# EAGLE schematic MotherboardRev2(1) (EAGLE 7.2.0)

## Sheet 1 of 12
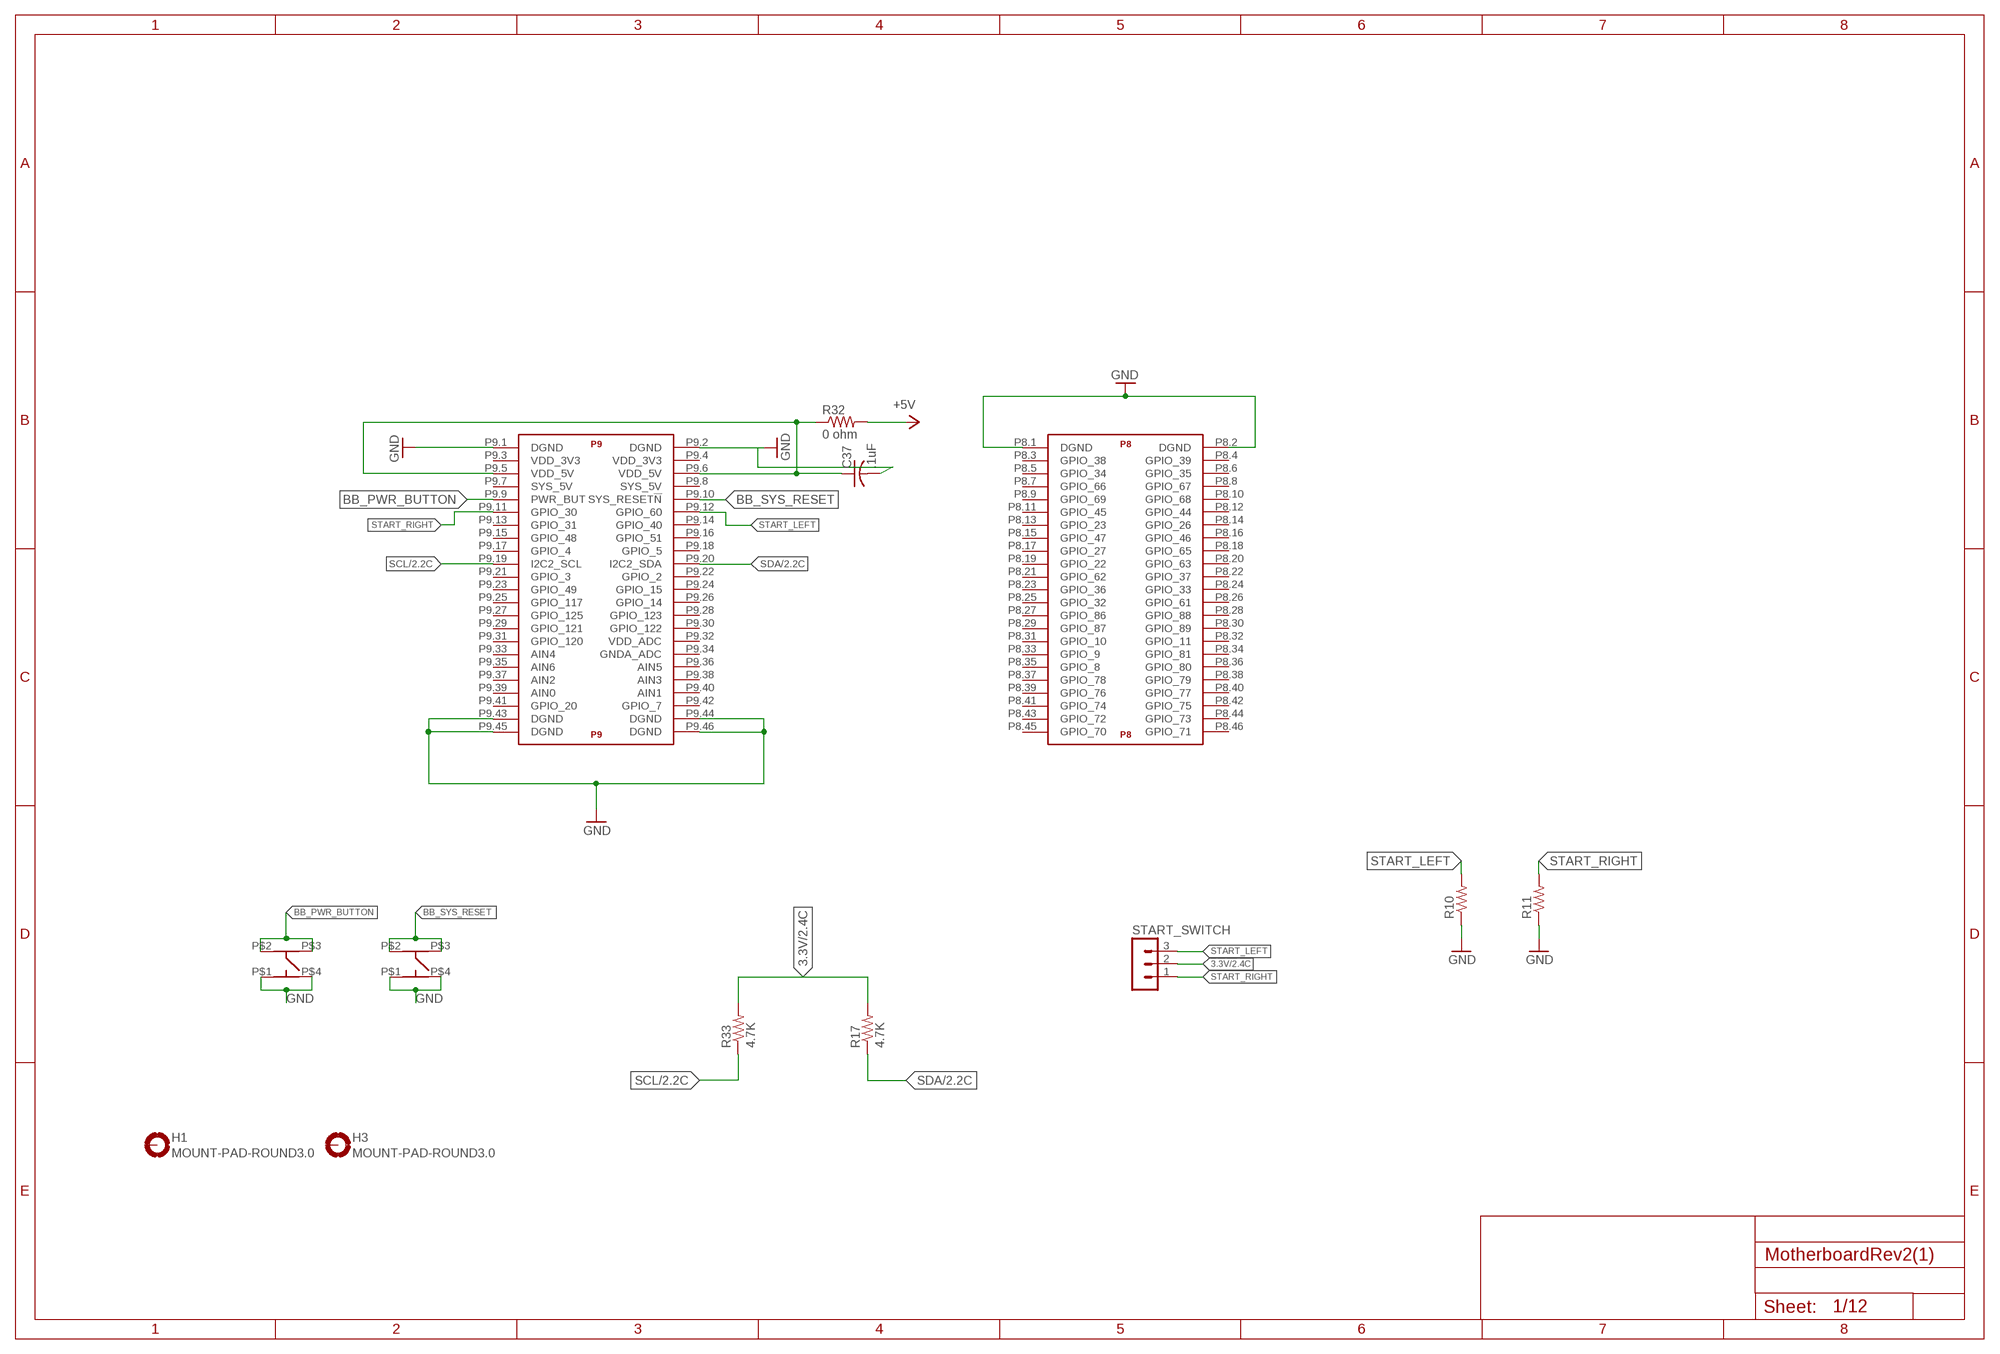
[diagram p0: schematic, sheet 1]

### Parts
C37  .1uF  C-USC0402  [C0402]
H1  MOUNT-PAD-ROUND3.0  [3,0-PAD]
H3  MOUNT-PAD-ROUND3.0  [3,0-PAD]
R10  R-US_R0402  [R0402]
R11  R-US_R0402  [R0402]
R17  4.7K  R-US_R0402  [R0402]
R32  0 ohm  R-US_R0402  [R0402]
R33  4.7K  R-US_R0402  [R0402]
START_SWITCH  MA03-1  [MA03-1]
U$1  BEAGLE_BONE_BLACK_CAPE  [BEAGLE_BONE_BLACK_CAPE]
U$13  Switch1  MC32882_SW  [MC32882_FINAL]
U$14  Switch1  MC32882_SW  [MC32882_FINAL]

### Nets
3.3V: R17.2 R33.2 START_SWITCH.2 ; also sheet 2,3,9,10
BB_PWR_BUTTON: U$1.P9.9(P9:PWR_BUT) U$13.P$2(P2) U$13.P$3(P3)
BB_SYS_RESET: U$1.P9.10(P9:SYS_RESET!N) U$14.P$2(P2) U$14.P$3(P3)
GND: C37.2 R10.1 R11.1 U$1.P8.1(P8:DGND) U$1.P8.2(P8:DGND) U$1.P9.1(P9:DGND) U$1.P9.2(P9:DGND) U$1.P9.43(P9:DGND) U$1.P9.44(P9:DGND) U$1.P9.45(P9:DGND) U$1.P9.46(P9:DGND) U$13.P$1(P1) U$13.P$4(P4) U$14.P$1(P1) U$14.P$4(P4) ; also sheet 2,3,4,5,6,7,8,9,10,11
N$18: C37.1 R32.1 U$1.P9.5(P9:VDD_5V) U$1.P9.6(P9:VDD_5V)
SCL: R33.1 U$1.P9.19(P9:I2C2_SCL) ; also sheet 2,10
SDA: R17.1 U$1.P9.20(P9:I2C2_SDA) ; also sheet 2,10
START_LEFT: R10.2 START_SWITCH.3 U$1.P9.12(P9:GPIO_60)
START_RIGHT: R11.2 START_SWITCH.1 U$1.P9.11(P9:GPIO_30)
VOUT1: R32.2 ; supply symbol labelled +5V ; also sheet 3,4,5
Unconnected: H1.B3,0(MOUNT) H3.B3,0(MOUNT) U$1.P8.3(P8:GPIO_38) U$1.P8.4(P8:GPIO_39) U$1.P8.5(P8:GPIO_34) U$1.P8.6(P8:GPIO_35) U$1.P8.7(P8:GPIO_66) U$1.P8.8(P8:GPIO_67) U$1.P8.9(P8:GPIO_69) U$1.P8.10(P8:GPIO_68) U$1.P8.11(P8:GPIO_45) U$1.P8.12(P8:GPIO_44) U$1.P8.13(P8:GPIO_23) U$1.P8.14(P8:GPIO_26) U$1.P8.15(P8:GPIO_47) U$1.P8.16(P8:GPIO_46) U$1.P8.17(P8:GPIO_27) U$1.P8.18(P8:GPIO_65) U$1.P8.19(P8:GPIO_22) U$1.P8.20(P8:GPIO_63) U$1.P8.21(P8:GPIO_62) U$1.P8.22(P8:GPIO_37) U$1.P8.23(P8:GPIO_36) U$1.P8.24(P8:GPIO_33) U$1.P8.25(P8:GPIO_32) U$1.P8.26(P8:GPIO_61) U$1.P8.27(P8:GPIO_86) U$1.P8.28(P8:GPIO_88) U$1.P8.29(P8:GPIO_87) U$1.P8.30(P8:GPIO_89) U$1.P8.31(P8:GPIO_10) U$1.P8.32(P8:GPIO_11) U$1.P8.33(P8:GPIO_9) U$1.P8.34(P8:GPIO_81) U$1.P8.35(P8:GPIO_8) U$1.P8.36(P8:GPIO_80) U$1.P8.37(P8:GPIO_78) U$1.P8.38(P8:GPIO_79) U$1.P8.39(P8:GPIO_76) U$1.P8.40(P8:GPIO_77) U$1.P8.41(P8:GPIO_74) U$1.P8.42(P8:GPIO_75) U$1.P8.43(P8:GPIO_72) U$1.P8.44(P8:GPIO_73) U$1.P8.45(P8:GPIO_70) U$1.P8.46(P8:GPIO_71) U$1.P9.3(P9:VDD_3V3) U$1.P9.4(P9:VDD_3V3) U$1.P9.7(P9:SYS_5V) U$1.P9.8(P9:SYS_5V) U$1.P9.13(P9:GPIO_31) U$1.P9.14(P9:GPIO_40) U$1.P9.15(P9:GPIO_48) U$1.P9.16(P9:GPIO_51) U$1.P9.17(P9:GPIO_4) U$1.P9.18(P9:GPIO_5) U$1.P9.21(P9:GPIO_3) U$1.P9.22(P9:GPIO_2) U$1.P9.23(P9:GPIO_49) U$1.P9.24(P9:GPIO_15) U$1.P9.25(P9:GPIO_117) U$1.P9.26(P9:GPIO_14) U$1.P9.27(P9:GPIO_125) U$1.P9.28(P9:GPIO_123) U$1.P9.29(P9:GPIO_121) U$1.P9.30(P9:GPIO_122) U$1.P9.31(P9:GPIO_120) U$1.P9.32(P9:VDD_ADC) U$1.P9.33(P9:AIN4) U$1.P9.34(P9:GNDA_ADC) U$1.P9.35(P9:AIN6) U$1.P9.36(P9:AIN5) U$1.P9.37(P9:AIN2) U$1.P9.38(P9:AIN3) U$1.P9.39(P9:AIN0) U$1.P9.40(P9:AIN1) U$1.P9.41(P9:GPIO_20) U$1.P9.42(P9:GPIO_7)

## Sheet 2 of 12
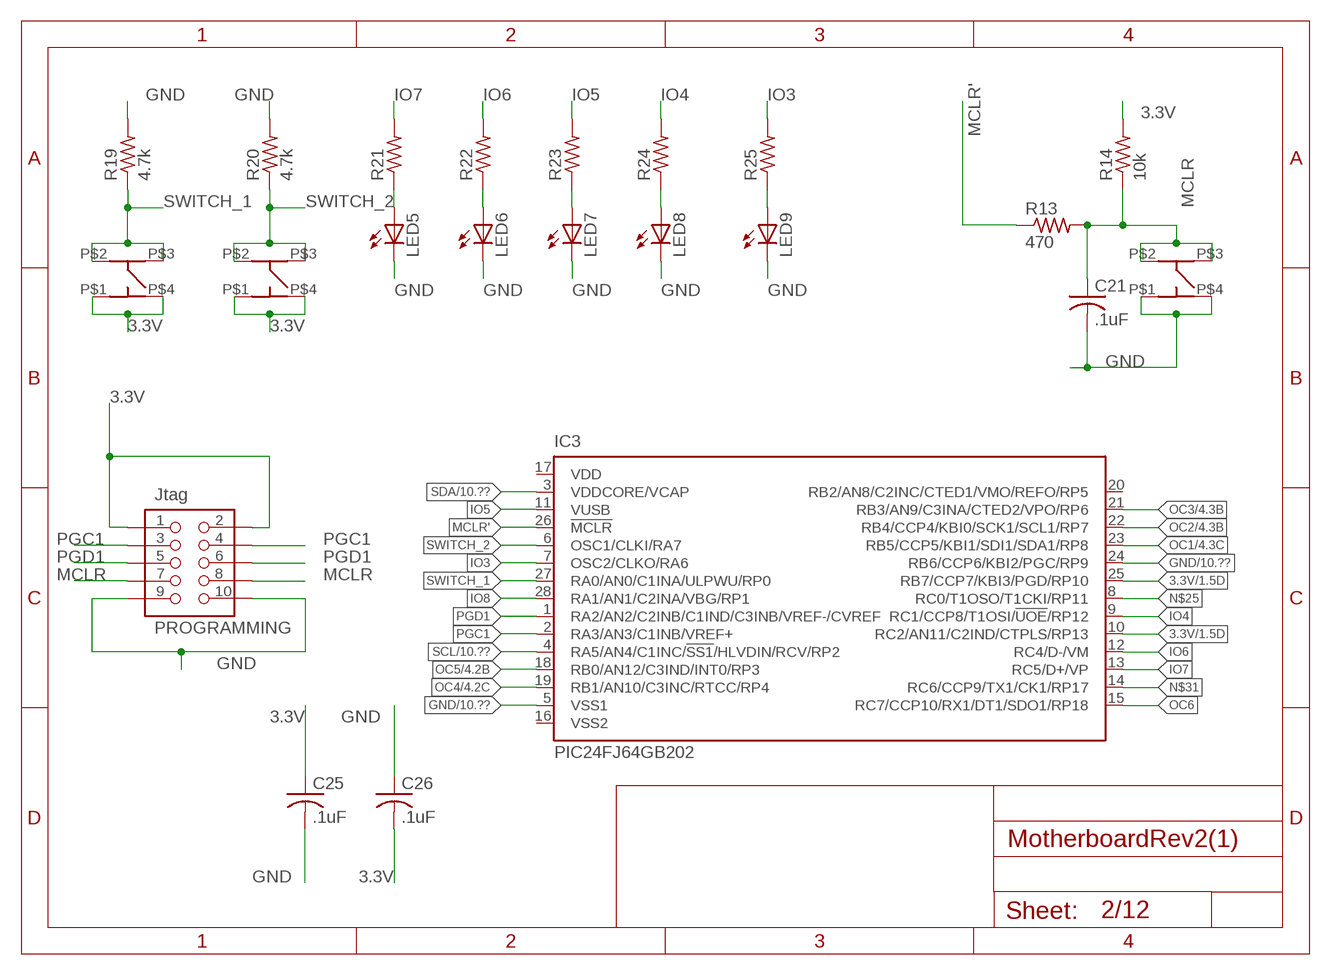
[diagram p1: schematic, sheet 2]

### Parts
C21  .1uF  C-USC0402  [C0402]
C25  .1uF  C-USC0402  [C0402]
C26  .1uF  C-USC0402  [C0402]
IC3  PIC24FJ64GB202  PIC18F26J53ML  [QFN28-ML_6X6MM]
LED5  LEDCHIPLED-0603-TTW  [CHIPLED-0603-TTW]
LED6  LEDCHIPLED-0603-TTW  [CHIPLED-0603-TTW]
LED7  LEDCHIPLED-0603-TTW  [CHIPLED-0603-TTW]
LED8  LEDCHIPLED-0603-TTW  [CHIPLED-0603-TTW]
LED9  LEDCHIPLED-0603-TTW  [CHIPLED-0603-TTW]
PROGRAMMING  Jtag  MOTHER-BOARD-REV5_PIN-CONNECTOR74089  [MOTHER-BOARD-REV5_10-PIN-SMD]
R13  470  R-US_R0402  [R0402]
R14  10k  R-US_R0402  [R0402]
R19  4.7k  R-US_R0402  [R0402]
R20  4.7k  R-US_R0402  [R0402]
R21  R-US_R0402  [R0402]
R22  R-US_R0402  [R0402]
R23  R-US_R0402  [R0402]
R24  R-US_R0402  [R0402]
R25  R-US_R0402  [R0402]
U$5  Switch3  MC32882_SW  [MC32882_FINAL]
U$6  Switch1  MC32882_SW  [MC32882_FINAL]
U$7  Switch2  MC32882_SW  [MC32882_FINAL]

### Nets
3.3V: C25.1 C26.1 IC3.10(RC2/AN11/C2IND/CTPLS/RP13) IC3.25(RB7/CCP7/KBI3/PGD/RP10) PROGRAMMING.1 PROGRAMMING.2 R14.2 U$6.P$1(P1) U$6.P$4(P4) U$7.P$1(P1) U$7.P$4(P4) ; also sheet 1,3,9,10
GND: C21.2 C25.2 C26.2 IC3.5(VSS1) IC3.24(RB6/CCP6/KBI2/PGC/RP9) LED5.C@1(C) LED6.C@1(C) LED7.C@1(C) LED8.C@1(C) LED9.C@1(C) PROGRAMMING.9 PROGRAMMING.10 R19.2 R20.2 U$5.P$1(P1) U$5.P$4(P4) ; also sheet 1,3,4,5,6,7,8,9,10,11
IO3: IC3.7(OSC2/CLKO/RA6) R25.2
IO4: IC3.9(RC1/CCP8/T1OSI/!UOE!/RP12) R24.2
IO5: IC3.11(VUSB) R23.2
IO6: IC3.12(RC4/D-/VM) R22.2
IO7: IC3.13(RC5/D+/VP) R21.2
IO8: IC3.28(RA1/AN1/C2INA/VBG/RP1)
MCLR: C21.1 PROGRAMMING.7 PROGRAMMING.8 R13.2 R14.1 U$5.P$2(P2) U$5.P$3(P3)
MCLR': IC3.26(!MCLR) R13.1
N$5: LED5.A@1(A) R21.1
N$6: LED6.A@1(A) R22.1
N$7: LED7.A@1(A) R23.1
N$8: LED8.A@1(A) R24.1
N$9: LED9.A@1(A) R25.1
N$25: IC3.8(RC0/T1OSO/T1CKI/RP11)
N$31: IC3.14(RC6/CCP9/TX1/CK1/RP17)
OC1: IC3.23(RB5/CCP5/KBI1/SDI1/SDA1/RP8) ; also sheet 4
OC2: IC3.22(RB4/CCP4/KBI0/SCK1/SCL1/RP7) ; also sheet 4
OC3: IC3.21(RB3/AN9/C3INA/CTED2/VPO/RP6) ; also sheet 4
OC4: IC3.19(RB1/AN10/C3INC/RTCC/RP4) ; also sheet 4
OC5: IC3.18(RB0/AN12/C3IND/INT0/RP3) ; also sheet 4
OC6: IC3.15(RC7/CCP10/RX1/DT1/SDO1/RP18) ; also sheet 4
PGC1: IC3.2(RA3/AN3/C1INB/VREF+) PROGRAMMING.3 PROGRAMMING.4
PGD1: IC3.1(RA2/AN2/C2INB/C1IND/C3INB/VREF-/CVREF) PROGRAMMING.5 PROGRAMMING.6
SCL: IC3.4(RA5/AN4/C1INC/!SS1!/HLVDIN/RCV/RP2) ; also sheet 1,10
SDA: IC3.3(VDDCORE/VCAP) ; also sheet 1,10
SWITCH_1: IC3.27(RA0/AN0/C1INA/ULPWU/RP0) R19.1 U$6.P$2(P2) U$6.P$3(P3)
SWITCH_2: IC3.6(OSC1/CLKI/RA7) R20.1 U$7.P$2(P2) U$7.P$3(P3)
Unconnected: IC3.16(VSS2) IC3.17(VDD) IC3.20(RB2/AN8/C2INC/CTED1/VMO/REFO/RP5)

## Sheet 3 of 12: Power System
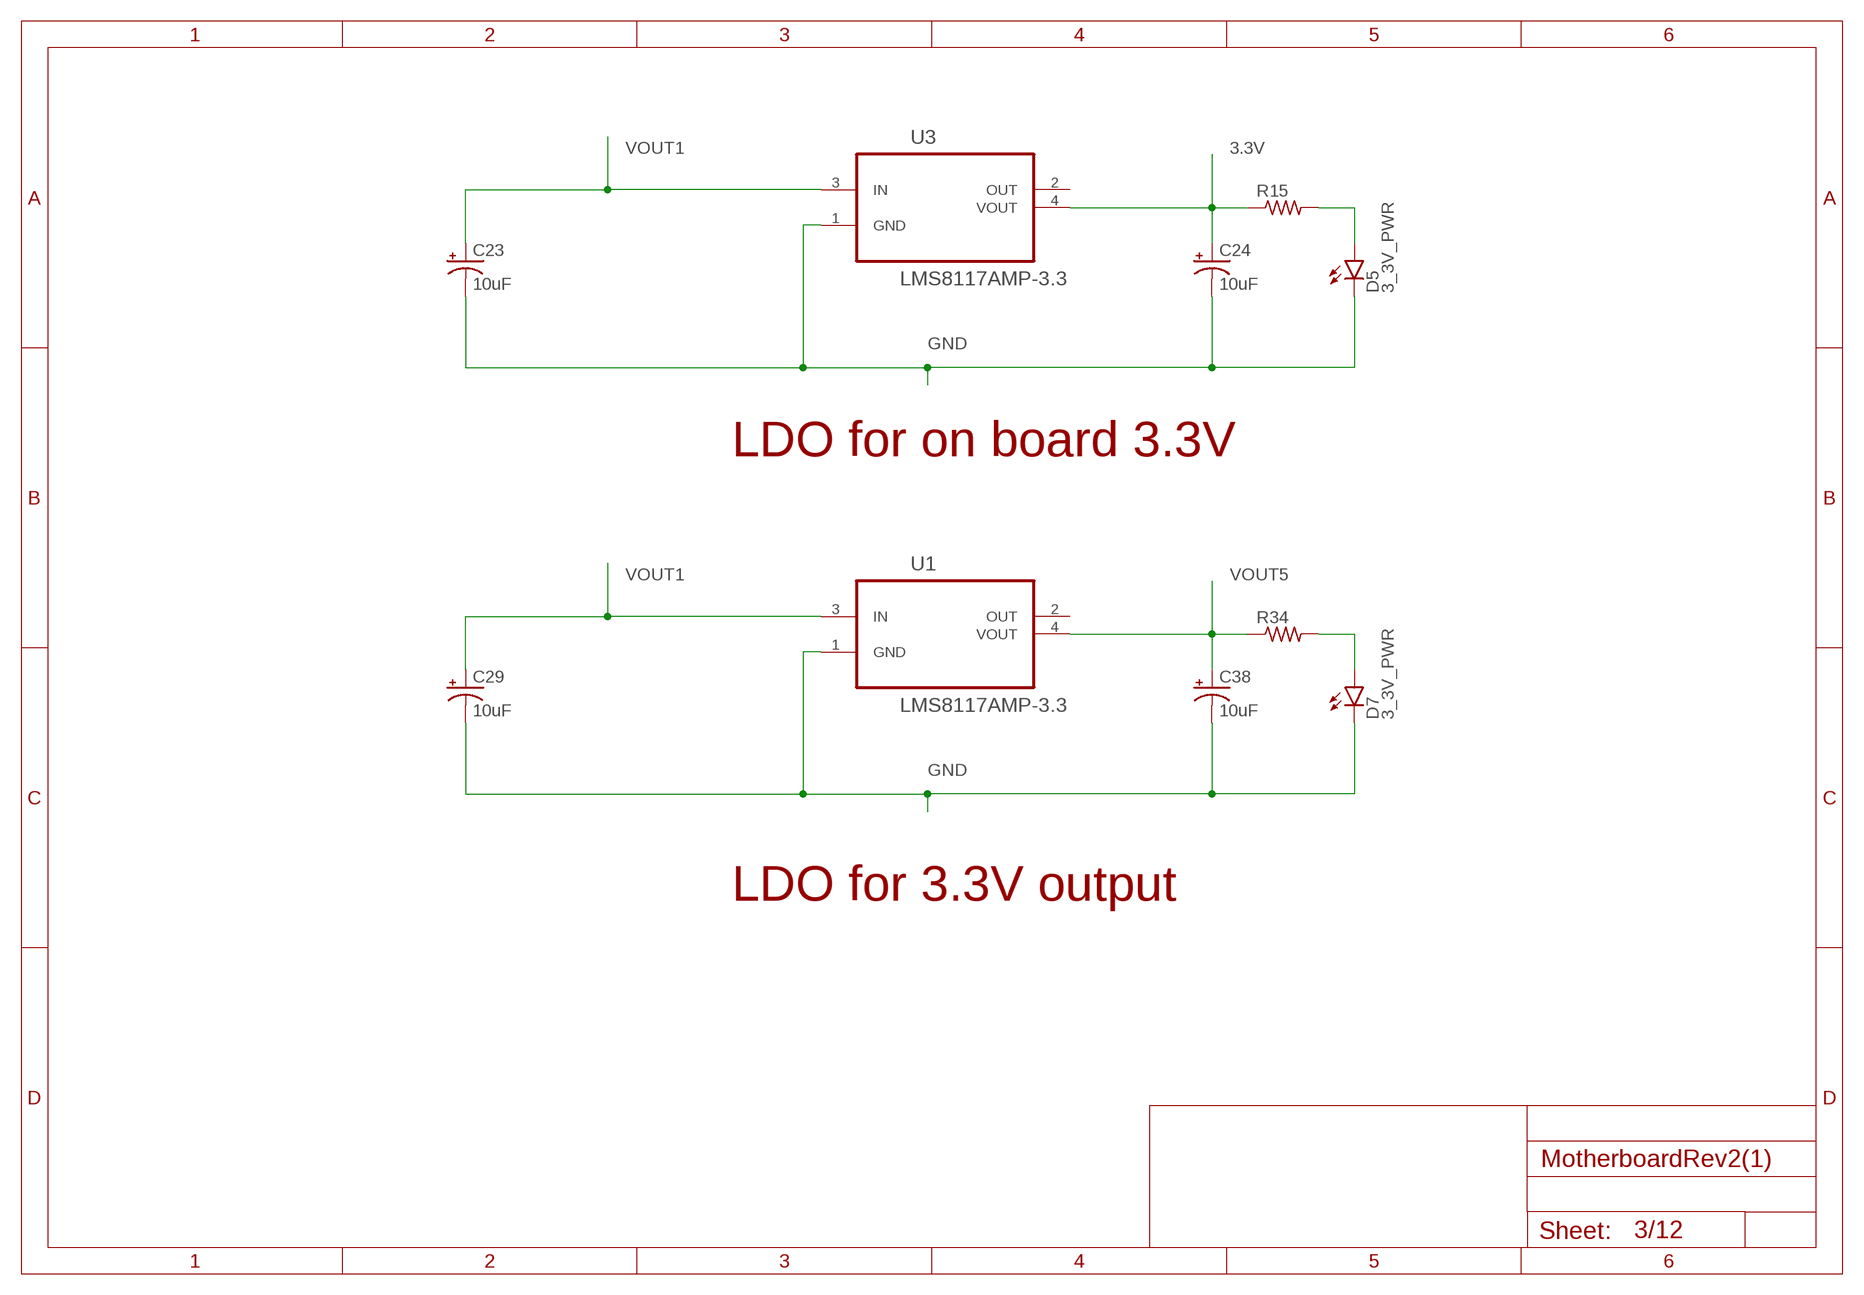
[diagram p2: schematic, sheet 3]

### Parts
C23  10uF  10UF-16V-10%(TANT)  [EIA3216]
C24  10uF  10UF-16V-10%(TANT)  [EIA3216]
C29  10uF  10UF-16V-10%(TANT)  [EIA3216]
C38  10uF  10UF-16V-10%(TANT)  [EIA3216]
D5  3_3V_PWR  LED-FKIT-1206  [FKIT-LED-1206]
D7  3_3V_PWR  LED-FKIT-1206  [FKIT-LED-1206]
R15  R-US_R0805W  [R0805W]
R34  R-US_R0805W  [R0805W]
U1  LMS8117AMP-3.3  [SOT230P696X180-4N]
U3  LMS8117AMP-3.3  [SOT230P696X180-4N]

### Nets
3.3V: C24.A(+) R15.1 U3.4(VOUT) ; also sheet 1,2,9,10
GND: C23.C(-) C24.C(-) C29.C(-) C38.C(-) D5.C D7.C U1.1(GND) U3.1(GND) ; also sheet 1,2,4,5,6,7,8,9,10,11
N$10: D5.A R15.2
N$11: D7.A R34.2
VOUT1: C23.A(+) C29.A(+) U1.3(IN) U3.3(IN) ; also sheet 1,4,5
VOUT5: C38.A(+) R34.1 U1.4(VOUT) ; also sheet 4
Unconnected: U1.2(OUT) U3.2(OUT)

### Notes on the sheet
- LDO for on board 3.3V
- LDO for 3.3V output

## Sheet 4 of 12
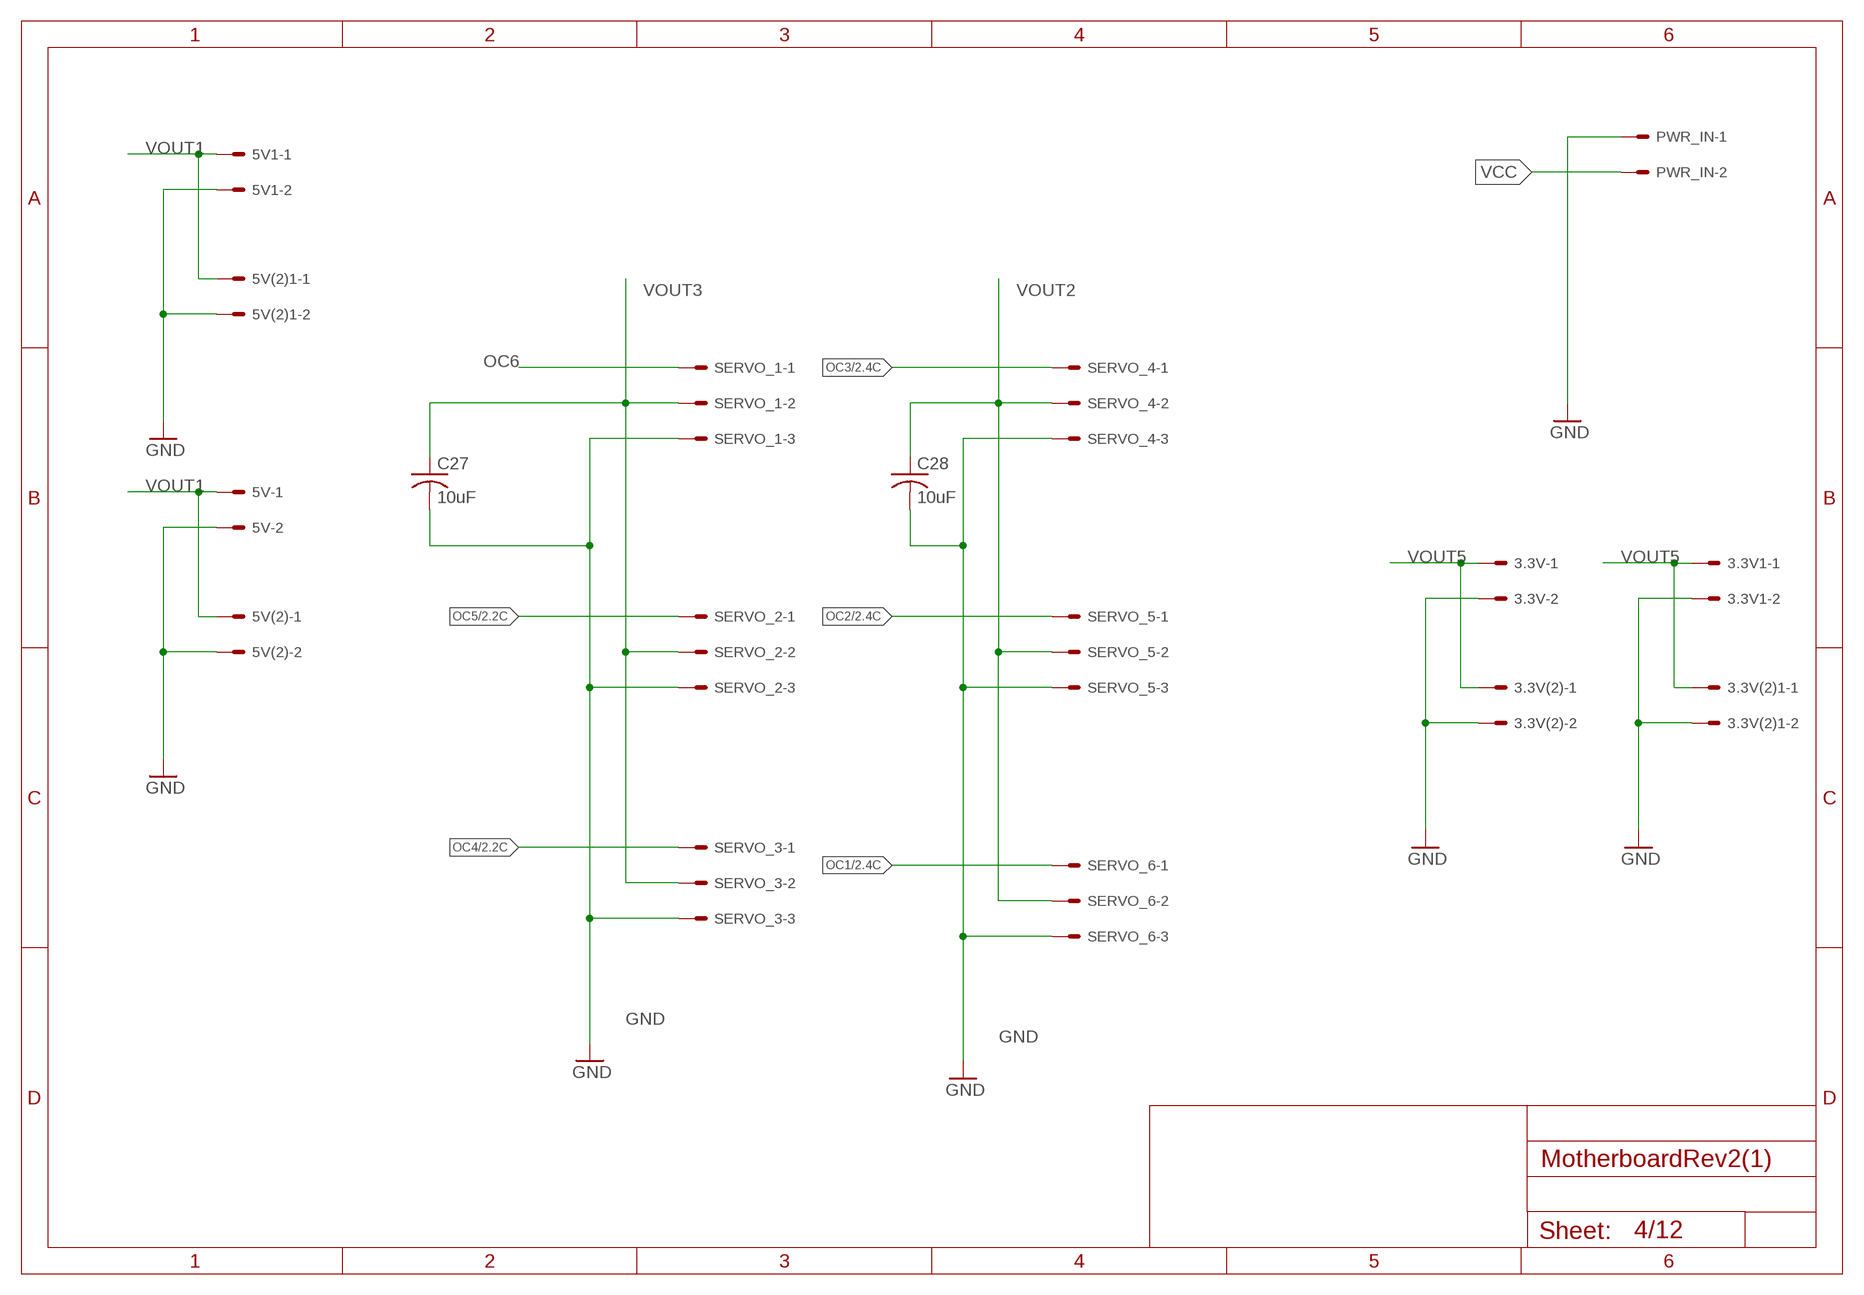
[diagram p3: schematic, sheet 4]

### Parts
3.3V  22-05-7028-02  [7395-02]
3.3V1  22-05-7028-02  [7395-02]
3.3V(2)  22-05-7028-02  [7395-02]
3.3V(2)1  22-05-7028-02  [7395-02]
5V  22-05-7028-02  [7395-02]
5V1  22-05-7028-02  [7395-02]
5V(2)  22-05-7028-02  [7395-02]
5V(2)1  22-05-7028-02  [7395-02]
C27  10uF  C-USC0805  [C0805]
C28  10uF  C-USC0805  [C0805]
PWR_IN  555X-2H  [5569-2]
SERVO_1  22-05-7038-03  [7395-03]
SERVO_2  22-05-7038-03  [7395-03]
SERVO_3  22-05-7038-03  [7395-03]
SERVO_4  22-05-7038-03  [7395-03]
SERVO_5  22-05-7038-03  [7395-03]
SERVO_6  22-05-7038-03  [7395-03]

### Nets
GND: 3.3V1.2 3.3V(2)1.2 3.3V(2).2 3.3V.2 5V1.2 5V(2)1.2 5V(2).2 5V.2 C27.2 C28.2 PWR_IN.1 SERVO_1.3 SERVO_2.3 SERVO_3.3 SERVO_4.3 SERVO_5.3 SERVO_6.3 ; also sheet 1,2,3,5,6,7,8,9,10,11
OC1: SERVO_6.1 ; also sheet 2
OC2: SERVO_5.1 ; also sheet 2
OC3: SERVO_4.1 ; also sheet 2
OC4: SERVO_3.1 ; also sheet 2
OC5: SERVO_2.1 ; also sheet 2
OC6: SERVO_1.1 ; also sheet 2
VCC: PWR_IN.2 ; also sheet 5,6,7,10,11
VOUT1: 5V1.1 5V(2)1.1 5V(2).1 5V.1 ; also sheet 1,3,5
VOUT2: C28.1 SERVO_4.2 SERVO_5.2 SERVO_6.2 ; also sheet 6
VOUT3: C27.1 SERVO_1.2 SERVO_2.2 SERVO_3.2 ; also sheet 7
VOUT5: 3.3V1.1 3.3V(2)1.1 3.3V(2).1 3.3V.1 ; also sheet 3

## Sheet 5 of 12
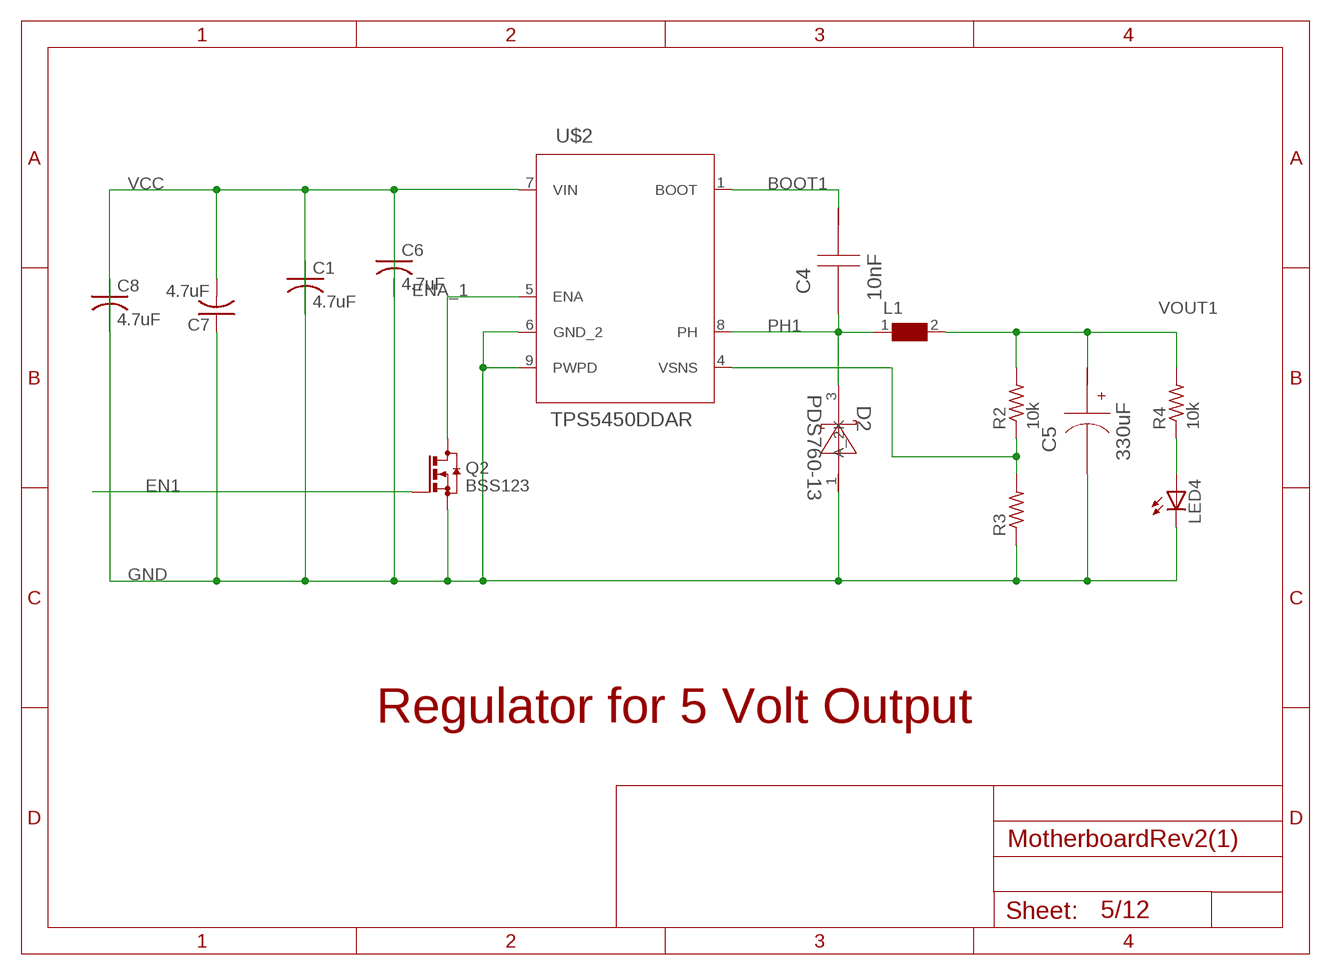
[diagram p4: schematic, sheet 5]

### Parts
C1  4.7uF  C-USC0805  [C0805]
C4  10nF  C0805C103K5RACTU  [0805]
C5  330uF  10SVP330MX  [SM_RADIAL_10AMM]
C6  4.7uF  C-USC0805  [C0805]
C7  4.7uF  C-USC0805  [C0805]
C8  4.7uF  C-USC0805  [C0805]
D2  PDS760-13  [POWERDI5]
L1  WE-HCC-7443331000_1090  [WE-HCC_1090]
LED4  LEDSML1206  [SML1206]
Q2  BSS123  [SOT23]
R2  10k  R-US_R1206  [R1206]
R3  R-US_R1206  [R1206]
R4  10k  R-US_R1206  [R1206]
U$2  TPS5450DDAR  [R-PDSO-G8]

### Nets
BOOT1: C4.1 U$2.1(BOOT)
EN1: Q2.1(G)
ENA_1: Q2.3(D) U$2.5(ENA)
GND: C1.1 C5.2(-) C6.1 C7.1 C8.1 D2.1(A_2) LED4.C Q2.2(S) R3.1 U$2.6(GND_2) U$2.9(PWPD) ; also sheet 1,2,3,4,6,7,8,9,10,11
N$1: LED4.A R4.1
PH1: C4.2 D2.3(K) L1.1 U$2.8(PH)
VCC: C1.2 C6.2 C7.2 C8.2 U$2.7(VIN) ; also sheet 4,6,7,10,11
VOUT1: C5.1(+) L1.2 R2.2 R4.2 ; also sheet 1,3,4
VSNS1: R2.1 R3.2 U$2.4(VSNS)

### Notes on the sheet
- Regulator for 5 Volt Output

## Sheet 6 of 12
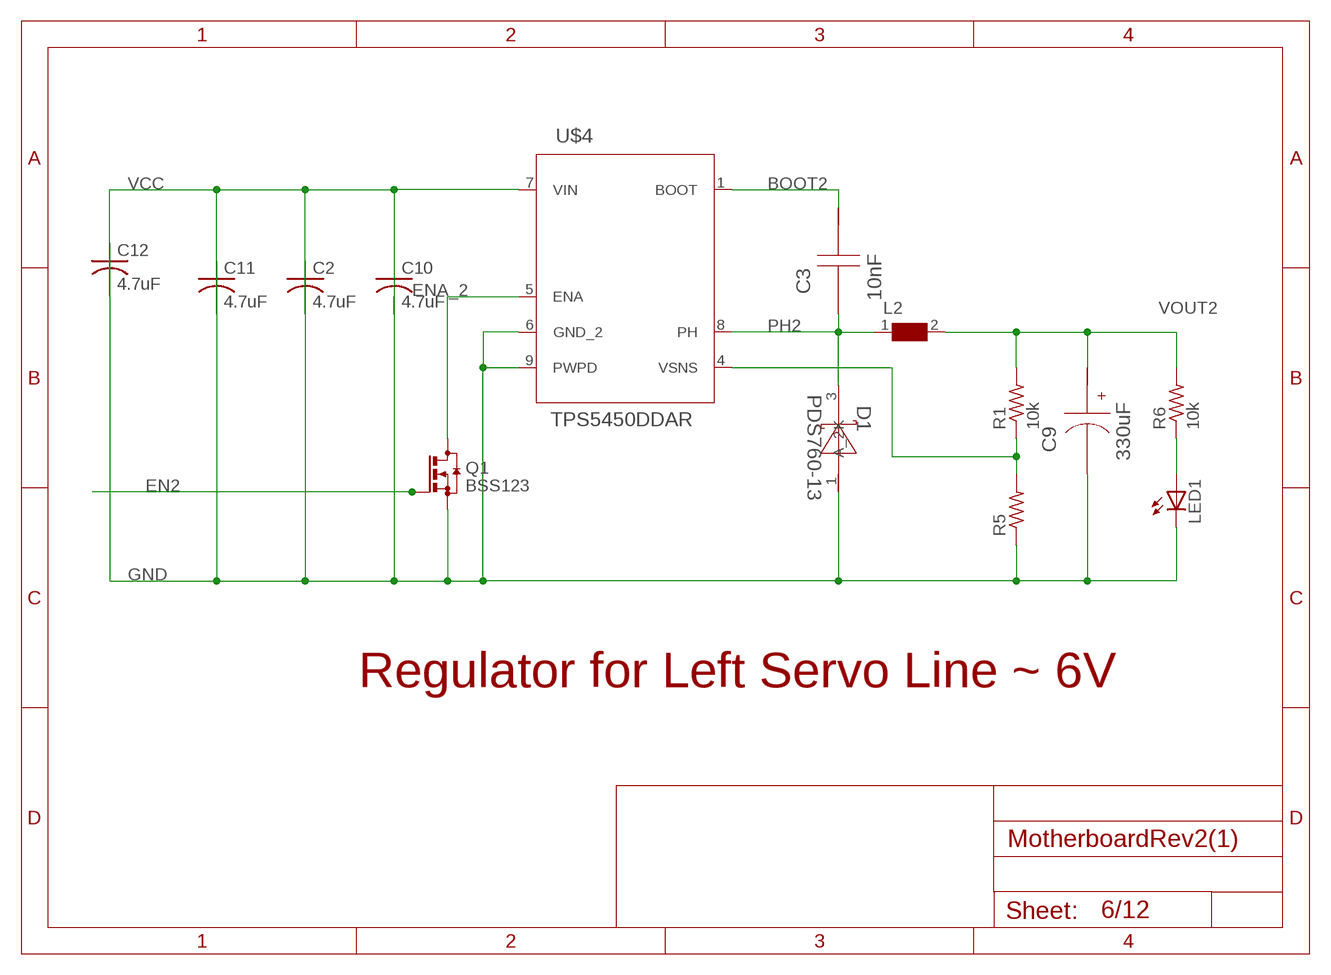
[diagram p5: schematic, sheet 6]

### Parts
C2  4.7uF  C-USC0805  [C0805]
C3  10nF  C0805C103K5RACTU  [0805]
C9  330uF  10SVP330MX  [SM_RADIAL_10AMM]
C10  4.7uF  C-USC0805  [C0805]
C11  4.7uF  C-USC0805  [C0805]
C12  4.7uF  C-USC0805  [C0805]
D1  PDS760-13  [POWERDI5]
L2  WE-HCC-7443331000_1090  [WE-HCC_1090]
LED1  LEDSML1206  [SML1206]
Q1  BSS123  [SOT23]
R1  10k  R-US_R1206  [R1206]
R5  R-US_R1206  [R1206]
R6  10k  R-US_R1206  [R1206]
U$4  TPS5450DDAR  [R-PDSO-G8]

### Nets
BOOT2: C3.1 U$4.1(BOOT)
EN2: Q1.1(G)
ENA_2: Q1.3(D) U$4.5(ENA)
GND: C2.1 C9.2(-) C10.1 C11.1 C12.1 D1.1(A_2) LED1.C Q1.2(S) R5.1 U$4.6(GND_2) U$4.9(PWPD) ; also sheet 1,2,3,4,5,7,8,9,10,11
N$2: LED1.A R6.1
PH2: C3.2 D1.3(K) L2.1 U$4.8(PH)
VCC: C2.2 C10.2 C11.2 C12.2 U$4.7(VIN) ; also sheet 4,5,7,10,11
VOUT2: C9.1(+) L2.2 R1.2 R6.2 ; also sheet 4
VSNS2: R1.1 R5.2 U$4.4(VSNS)

### Notes on the sheet
- Regulator for Left Servo Line ~ 6V

## Sheet 7 of 12
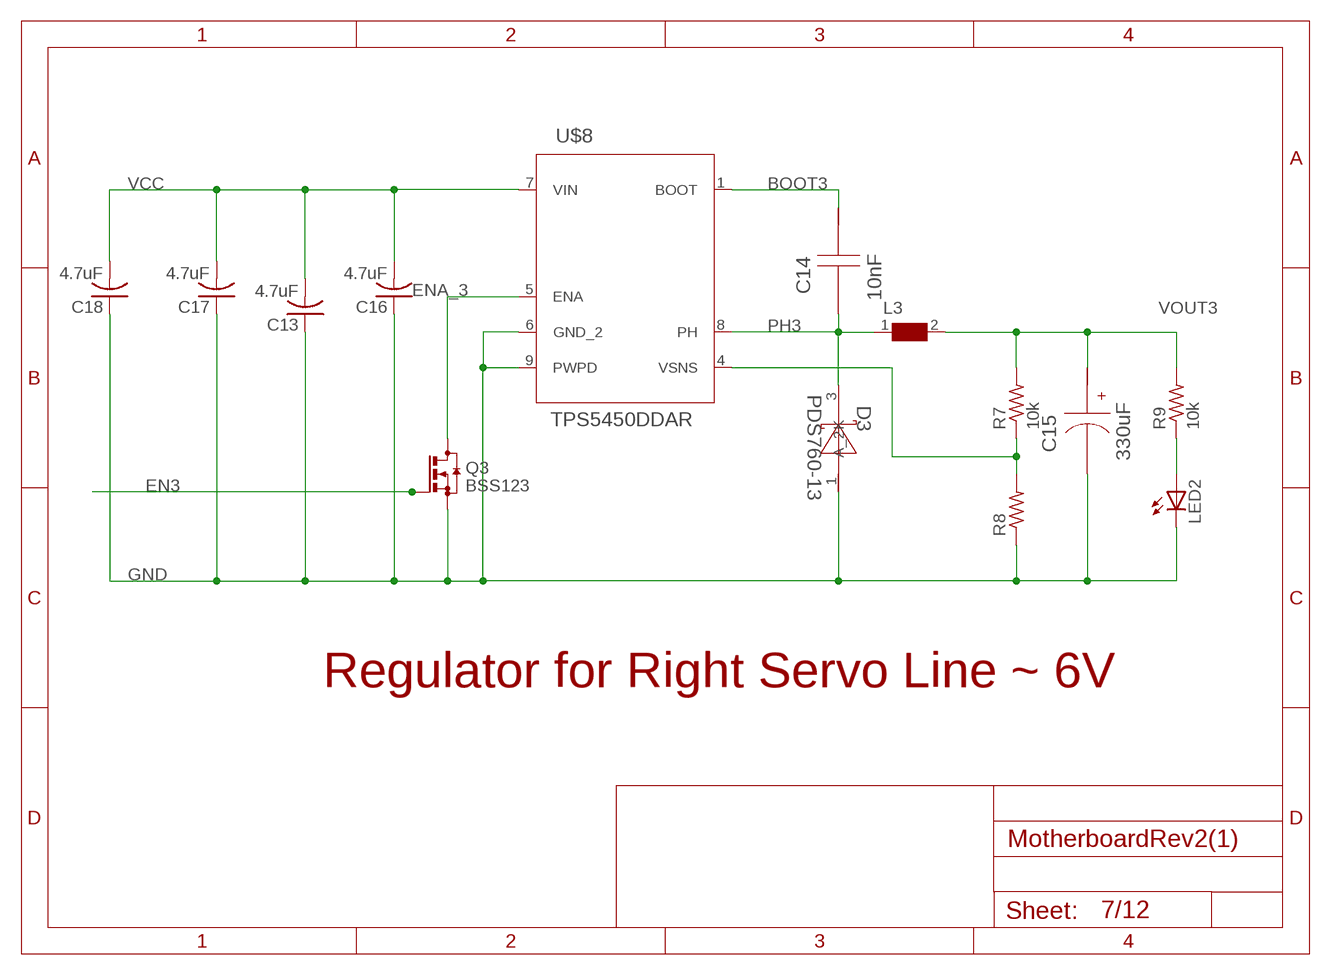
[diagram p6: schematic, sheet 7]

### Parts
C13  4.7uF  C-USC0805  [C0805]
C14  10nF  C0805C103K5RACTU  [0805]
C15  330uF  10SVP330MX  [SM_RADIAL_10AMM]
C16  4.7uF  C-USC0805  [C0805]
C17  4.7uF  C-USC0805  [C0805]
C18  4.7uF  C-USC0805  [C0805]
D3  PDS760-13  [POWERDI5]
L3  WE-HCC-7443331000_1090  [WE-HCC_1090]
LED2  LEDSML1206  [SML1206]
Q3  BSS123  [SOT23]
R7  10k  R-US_R1206  [R1206]
R8  R-US_R1206  [R1206]
R9  10k  R-US_R1206  [R1206]
U$8  TPS5450DDAR  [R-PDSO-G8]

### Nets
BOOT3: C14.1 U$8.1(BOOT)
EN3: Q3.1(G)
ENA_3: Q3.3(D) U$8.5(ENA)
GND: C13.1 C15.2(-) C16.1 C17.1 C18.1 D3.1(A_2) LED2.C Q3.2(S) R8.1 U$8.6(GND_2) U$8.9(PWPD) ; also sheet 1,2,3,4,5,6,8,9,10,11
N$3: LED2.A R9.1
PH3: C14.2 D3.3(K) L3.1 U$8.8(PH)
VCC: C13.2 C16.2 C17.2 C18.2 U$8.7(VIN) ; also sheet 4,5,6,10,11
VOUT3: C15.1(+) L3.2 R7.2 R9.2 ; also sheet 4
VSNS3: R7.1 R8.2 U$8.4(VSNS)

### Notes on the sheet
- Regulator for Right Servo Line ~ 6V

## Sheet 8 of 12
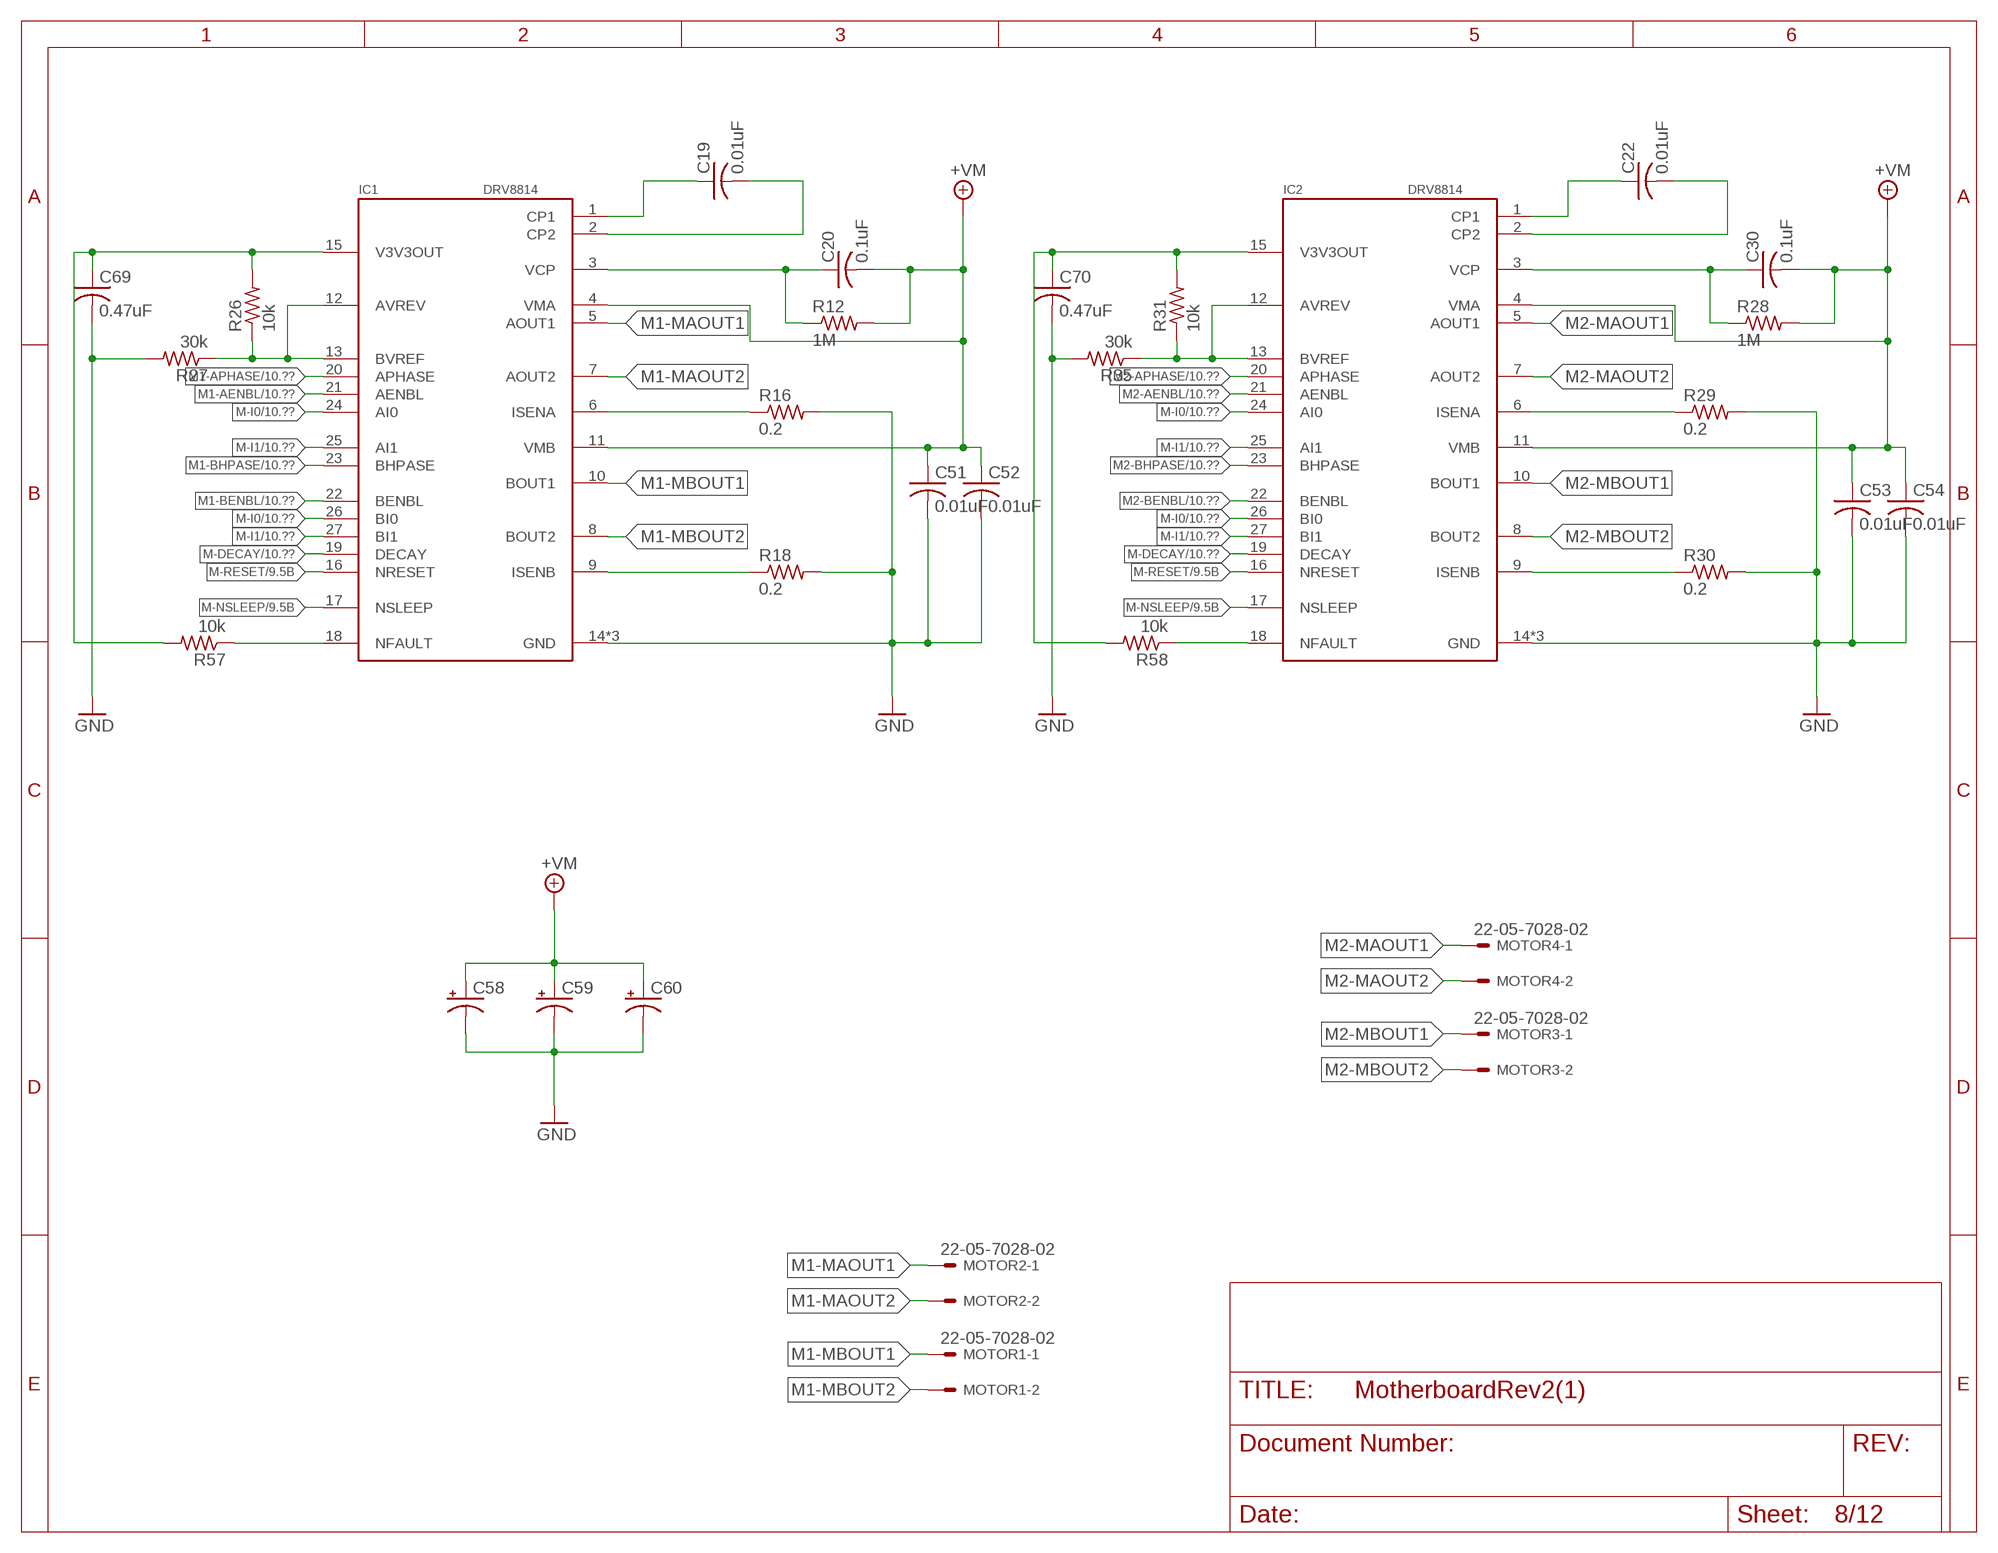
[diagram p7: schematic, sheet 8]

### Parts
C19  0.01uF  C-USC0402  [C0402]
C20  0.1uF  C-USC0402  [C0402]
C22  0.01uF  C-USC0402  [C0402]
C30  0.1uF  C-USC0402  [C0402]
C51  0.01uF  C-USC0402  [C0402]
C52  0.01uF  C-USC0402  [C0402]
C53  0.01uF  C-USC0402  [C0402]
C54  0.01uF  C-USC0402  [C0402]
C58  CPOL-US153CLV-0605  [153CLV-0605]
C59  CPOL-US153CLV-0605  [153CLV-0605]
C60  CPOL-US153CLV-0605  [153CLV-0605]
C69  0.47uF  C-USC0402  [C0402]
C70  0.47uF  C-USC0402  [C0402]
IC1  DRV8814  DRV8818PWPR  [TSSOP-28]
IC2  DRV8814  DRV8818PWPR  [TSSOP-28]
MOTOR1  22-05-7028-02  [7395-02]
MOTOR2  22-05-7028-02  [7395-02]
MOTOR3  22-05-7028-02  [7395-02]
MOTOR4  22-05-7028-02  [7395-02]
R12  1M  R-US_R0402  [R0402]
R16  0.2  R-US_R0402  [R0402]
R18  0.2  R-US_R0402  [R0402]
R26  10k  R-US_R0402  [R0402]
R27  30k  R-US_R0402  [R0402]
R28  1M  R-US_R0402  [R0402]
R29  0.2  R-US_R0402  [R0402]
R30  0.2  R-US_R0402  [R0402]
R31  10k  R-US_R0402  [R0402]
R35  30k  R-US_R0402  [R0402]
R57  10k  R-US_R0402  [R0402]
R58  10k  R-US_R0402  [R0402]

### Nets
+7V [VM]: C20.2 C30.2 C51.1 C52.1 C53.1 C54.1 C58.+ C59.+ C60.+ IC1.4(VMA) IC1.11(VMB) IC2.4(VMA) IC2.11(VMB) R12.2 R28.2 ; supply symbol labelled +VM ; also sheet 9,10,11
GND: C51.2 C52.2 C53.2 C54.2 C58.- C59.- C60.- C69.2 C70.2 IC1.14(GND) IC1.28(GND) IC1.EXP(GND) IC2.14(GND) IC2.28(GND) IC2.EXP(GND) R16.2 R18.2 R27.2 R29.2 R30.2 R35.2 ; also sheet 1,2,3,4,5,6,7,9,10,11
M1-AENBL: IC1.21(AENBL) ; also sheet 10
M1-APHASE: IC1.20(APHASE) ; also sheet 10
M1-BENBL: IC1.22(BENBL) ; also sheet 10
M1-BHPASE: IC1.23(BHPASE) ; also sheet 10
M1-MAOUT1: IC1.5(AOUT1) MOTOR2.1
M1-MAOUT2: IC1.7(AOUT2) MOTOR2.2
M1-MBOUT1: IC1.10(BOUT1) MOTOR1.1
M1-MBOUT2: IC1.8(BOUT2) MOTOR1.2
M2-AENBL: IC2.21(AENBL) ; also sheet 10
M2-APHASE: IC2.20(APHASE) ; also sheet 10
M2-BENBL: IC2.22(BENBL) ; also sheet 10
M2-BHPASE: IC2.23(BHPASE) ; also sheet 10
M2-MAOUT1: IC2.5(AOUT1) MOTOR4.1
M2-MAOUT2: IC2.7(AOUT2) MOTOR4.2
M2-MBOUT1: IC2.10(BOUT1) MOTOR3.1
M2-MBOUT2: IC2.8(BOUT2) MOTOR3.2
M-DECAY: IC1.19(DECAY) IC2.19(DECAY) ; also sheet 10
M-I0: IC1.24(AI0) IC1.26(BI0) IC2.24(AI0) IC2.26(BI0) ; also sheet 10
M-I1: IC1.25(AI1) IC1.27(BI1) IC2.25(AI1) IC2.27(BI1) ; also sheet 10
M-NSLEEP: IC1.17(NSLEEP) IC2.17(NSLEEP) ; also sheet 9,10
M-RESET: IC1.16(NRESET) IC2.16(NRESET) ; also sheet 9,10
N$4: C19.2 IC1.2(CP2)
N$12: C19.1 IC1.1(CP1)
N$13: C20.1 IC1.3(VCP) R12.1
N$14: IC1.6(ISENA) R16.1
N$15: IC1.9(ISENB) R18.1
N$16: IC1.12(AVREV) IC1.13(BVREF) R26.1 R27.1
N$17: C22.2 IC2.2(CP2)
N$20: C22.1 IC2.1(CP1)
N$21: C30.1 IC2.3(VCP) R28.1
N$22: IC2.6(ISENA) R29.1
N$23: IC2.9(ISENB) R30.1
N$24: IC2.12(AVREV) IC2.13(BVREF) R31.1 R35.1
N$26: IC1.18(NFAULT) R57.1
N$29 [+3v3]: C69.1 IC1.15(V3V3OUT) R26.2 R57.2
N$35: IC2.18(NFAULT) R58.1
N$37 [+3v3]: C70.1 IC2.15(V3V3OUT) R31.2 R58.2

## Sheet 9 of 12
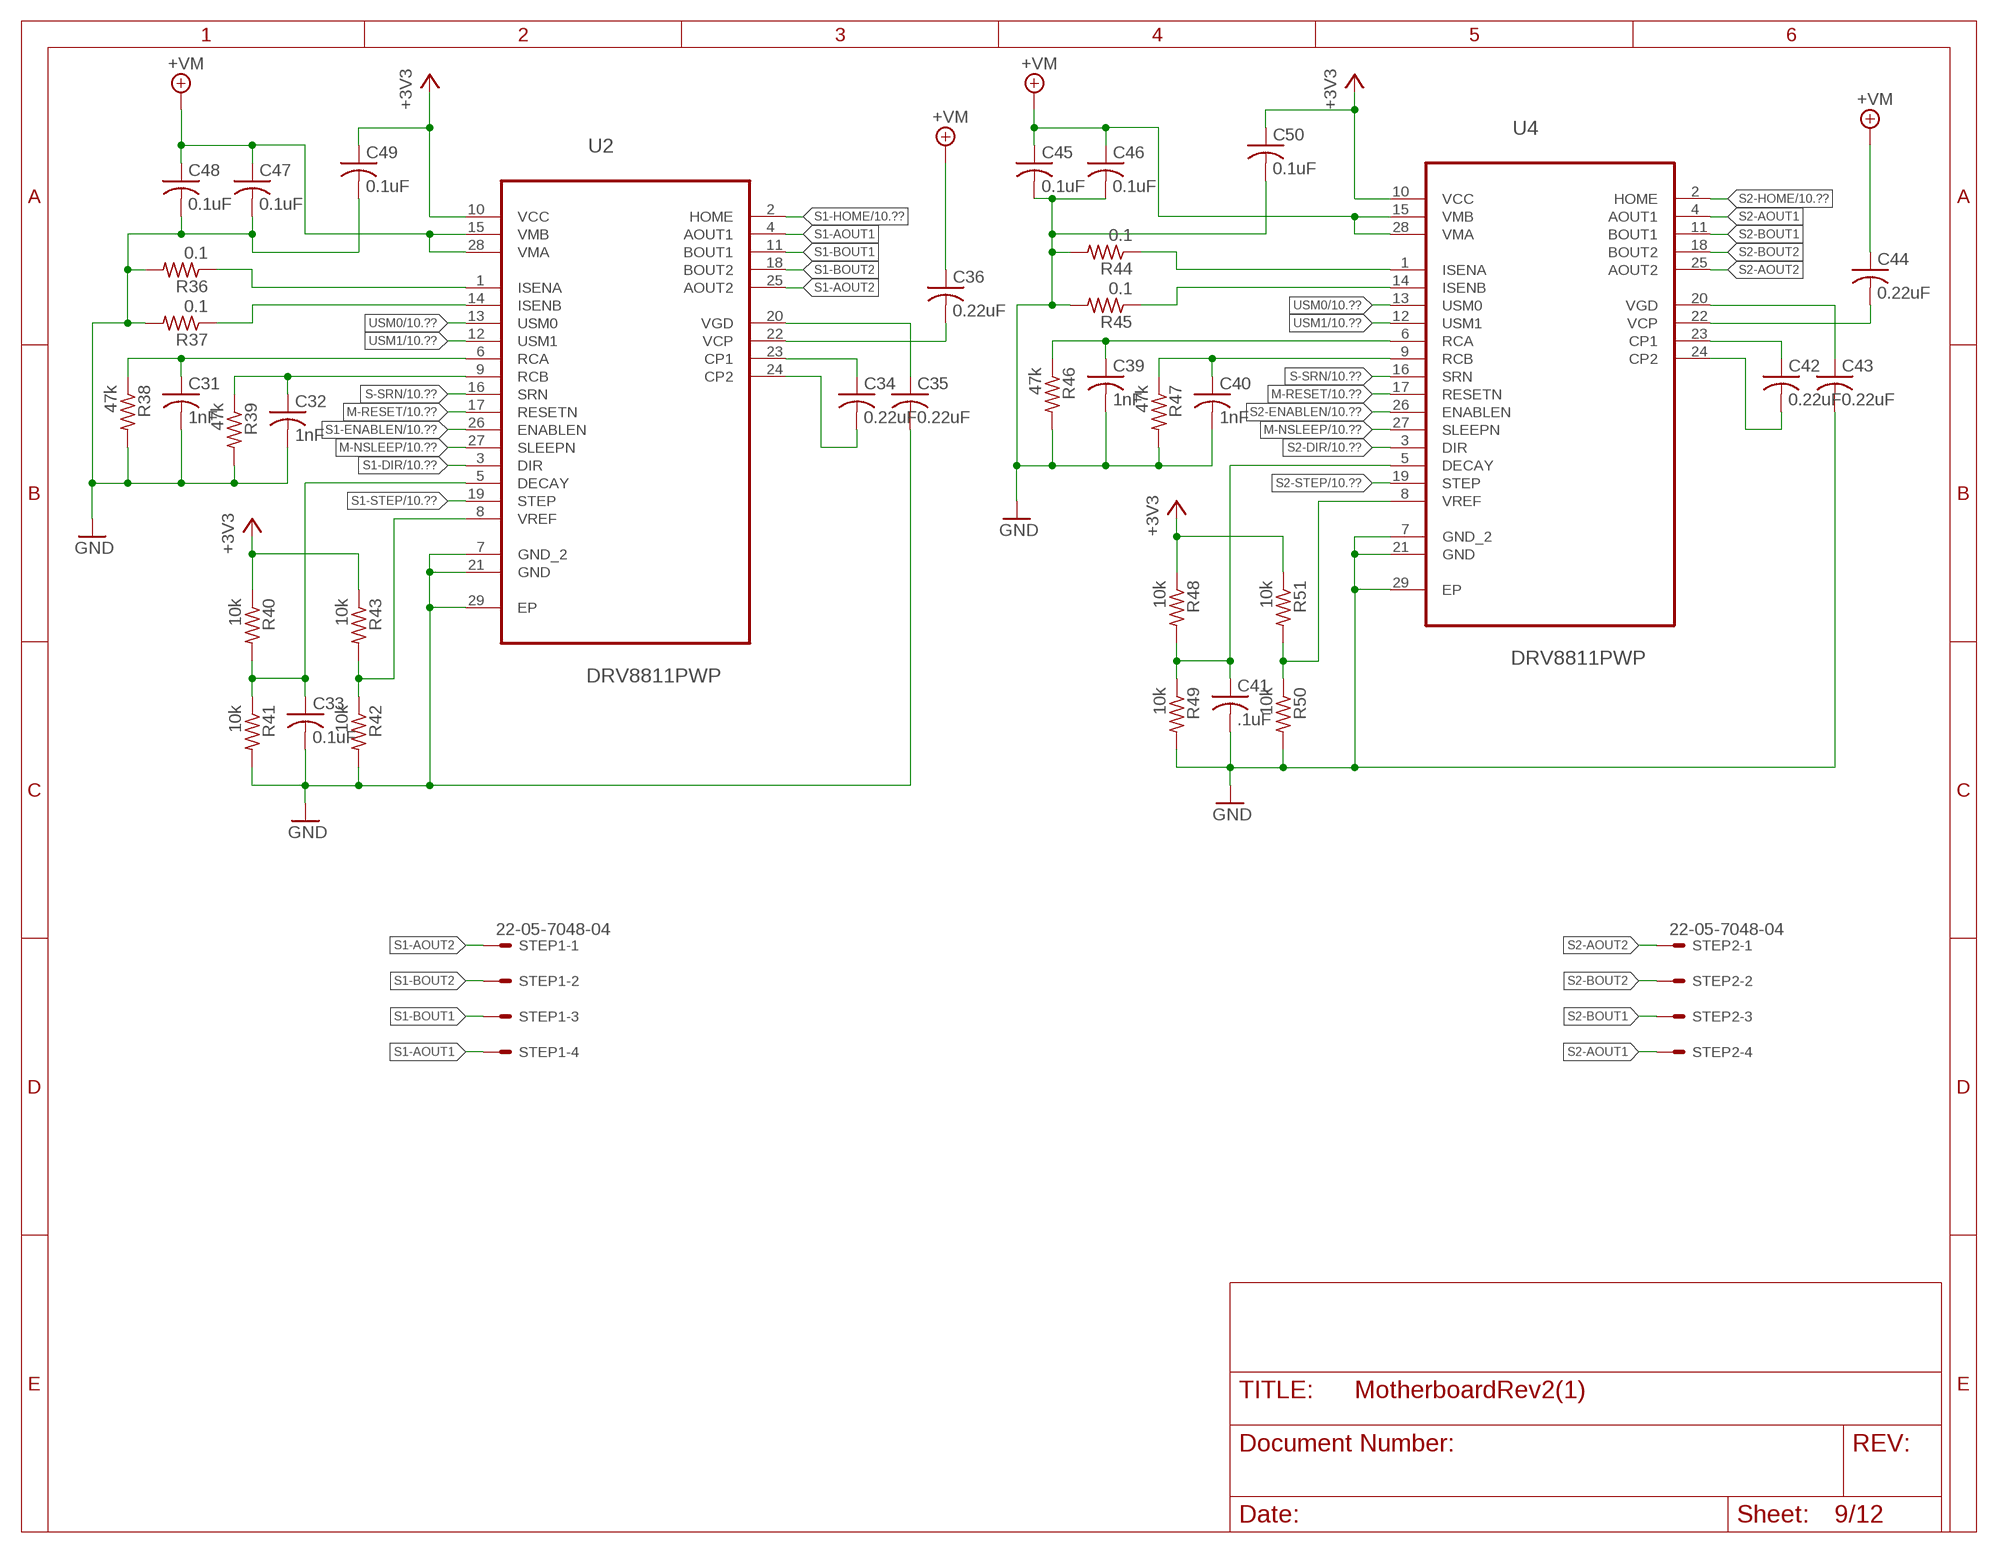
[diagram p8: schematic, sheet 9]

### Parts
C31  1nF  C-USC0402  [C0402]
C32  1nF  C-USC0402  [C0402]
C33  0.1uF  C-USC0402  [C0402]
C34  0.22uF  C-USC0402  [C0402]
C35  0.22uF  C-USC0402  [C0402]
C36  0.22uF  C-USC0402  [C0402]
C39  1nF  C-USC0402  [C0402]
C40  1nF  C-USC0402  [C0402]
C41  .1uF  C-USC0402  [C0402]
C42  0.22uF  C-USC0402  [C0402]
C43  0.22uF  C-USC0402  [C0402]
C44  0.22uF  C-USC0402  [C0402]
C45  0.1uF  C-USC0402  [C0402]
C46  0.1uF  C-USC0402  [C0402]
C47  0.1uF  C-USC0402  [C0402]
C48  0.1uF  C-USC0402  [C0402]
C49  0.1uF  C-USC0402  [C0402]
C50  0.1uF  C-USC0402  [C0402]
R36  0.1  R-US_R0402  [R0402]
R37  0.1  R-US_R0402  [R0402]
R38  47k  R-US_R0402  [R0402]
R39  47k  R-US_R0402  [R0402]
R40  10k  R-US_R0402  [R0402]
R41  10k  R-US_R0402  [R0402]
R42  10k  R-US_R0402  [R0402]
R43  10k  R-US_R0402  [R0402]
R44  0.1  R-US_R0402  [R0402]
R45  0.1  R-US_R0402  [R0402]
R46  47k  R-US_R0402  [R0402]
R47  47k  R-US_R0402  [R0402]
R48  10k  R-US_R0402  [R0402]
R49  10k  R-US_R0402  [R0402]
R50  10k  R-US_R0402  [R0402]
R51  10k  R-US_R0402  [R0402]
STEP1  22-05-7048-04  [7395-04]
STEP2  22-05-7048-04  [7395-04]
U2  DRV8811PWP  [SOP65P640X120-29N]
U4  DRV8811PWP  [SOP65P640X120-29N]

### Nets
3.3V: C49.1 C50.1 R40.1 R43.1 R48.1 R51.1 U2.10(VCC) U4.10(VCC) ; supply symbol labelled +3V3 ; also sheet 1,2,3,10
+7V [VM]: C36.1 C44.1 C45.1 C46.1 C47.1 C48.1 U2.15(VMB) U2.28(VMA) U4.15(VMB) U4.28(VMA) ; supply symbol labelled +VM ; also sheet 8,10,11
GND: C31.2 C32.2 C33.2 C35.2 C39.2 C40.2 C41.2 C43.2 C45.2 C46.2 C47.2 C48.2 C49.2 C50.2 R36.2 R37.2 R38.2 R39.2 R41.2 R42.2 R44.2 R45.2 R46.2 R47.2 R49.2 R50.2 U2.7(GND_2) U2.21(GND) U2.29(EP) U4.7(GND_2) U4.21(GND) U4.29(EP) ; also sheet 1,2,3,4,5,6,7,8,10,11
M-NSLEEP: U2.27(SLEEPN) U4.27(SLEEPN) ; also sheet 8,10
M-RESET: U2.17(RESETN) U4.17(RESETN) ; also sheet 8,10
N$27: R37.1 U2.14(ISENB)
N$28: R36.1 U2.1(ISENA)
N$30: C31.1 R38.1 U2.6(RCA)
N$32: C32.1 R39.1 U2.9(RCB)
N$33: C33.1 R40.2 R41.1 U2.5(DECAY)
N$34: R42.1 R43.2 U2.8(VREF)
N$36: C34.1 U2.23(CP1)
N$38: C34.2 U2.24(CP2)
N$39: C35.1 U2.20(VGD)
N$40: C36.2 U2.22(VCP)
N$41: R45.1 U4.14(ISENB)
N$42: R44.1 U4.1(ISENA)
N$43: C39.1 R46.1 U4.6(RCA)
N$44: C40.1 R47.1 U4.9(RCB)
N$45: C41.1 R48.2 R49.1 U4.5(DECAY)
N$46: R50.1 R51.2 U4.8(VREF)
N$47: C42.1 U4.23(CP1)
N$48: C42.2 U4.24(CP2)
N$49: C43.1 U4.20(VGD)
N$50: C44.2 U4.22(VCP)
S1-AOUT1: STEP1.4 U2.4(AOUT1)
S1-AOUT2: STEP1.1 U2.25(AOUT2)
S1-BOUT1: STEP1.3 U2.11(BOUT1)
S1-BOUT2: STEP1.2 U2.18(BOUT2)
S1-DIR: U2.3(DIR) ; also sheet 10
S1-ENABLEN: U2.26(ENABLEN) ; also sheet 10
S1-HOME: U2.2(HOME) ; also sheet 10
S1-STEP: U2.19(STEP) ; also sheet 10
S2-AOUT1: STEP2.4 U4.4(AOUT1)
S2-AOUT2: STEP2.1 U4.25(AOUT2)
S2-BOUT1: STEP2.3 U4.11(BOUT1)
S2-BOUT2: STEP2.2 U4.18(BOUT2)
S2-DIR: U4.3(DIR) ; also sheet 10
S2-ENABLEN: U4.26(ENABLEN) ; also sheet 10
S2-HOME: U4.2(HOME) ; also sheet 10
S2-STEP: U4.19(STEP) ; also sheet 10
S-SRN: U2.16(SRN) U4.16(SRN) ; also sheet 10
USM0: U2.13(USM0) U4.13(USM0) ; also sheet 10
USM1: U2.12(USM1) U4.12(USM1) ; also sheet 10

## Sheet 10 of 12
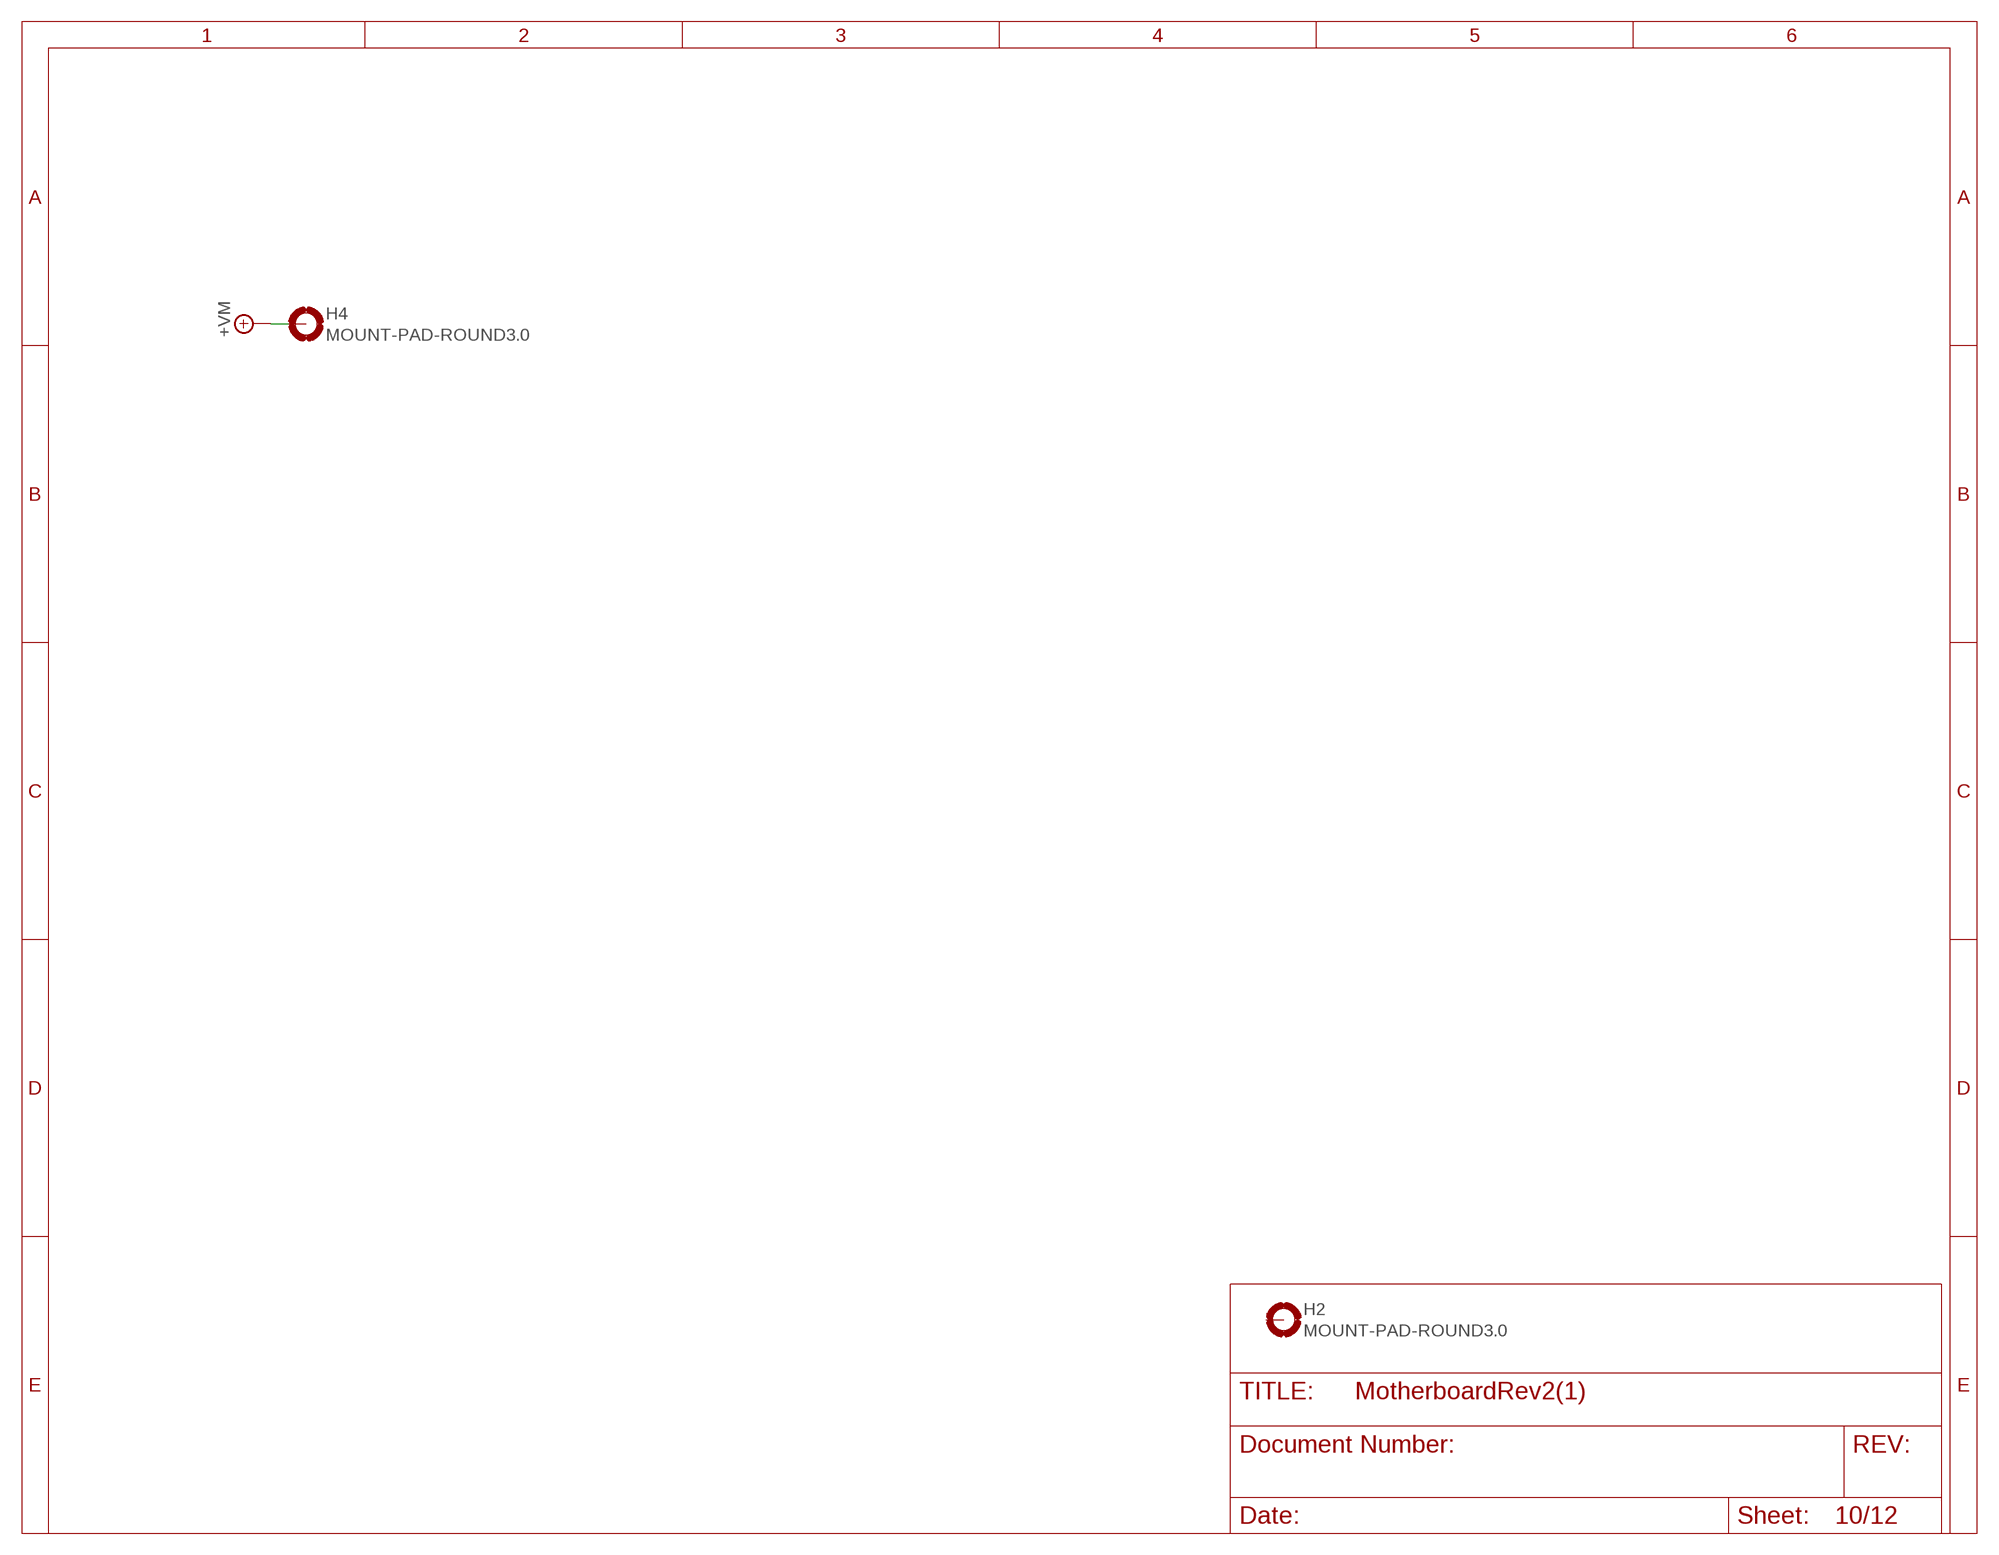
[diagram p9: schematic, sheet 10, part 1 of 2]
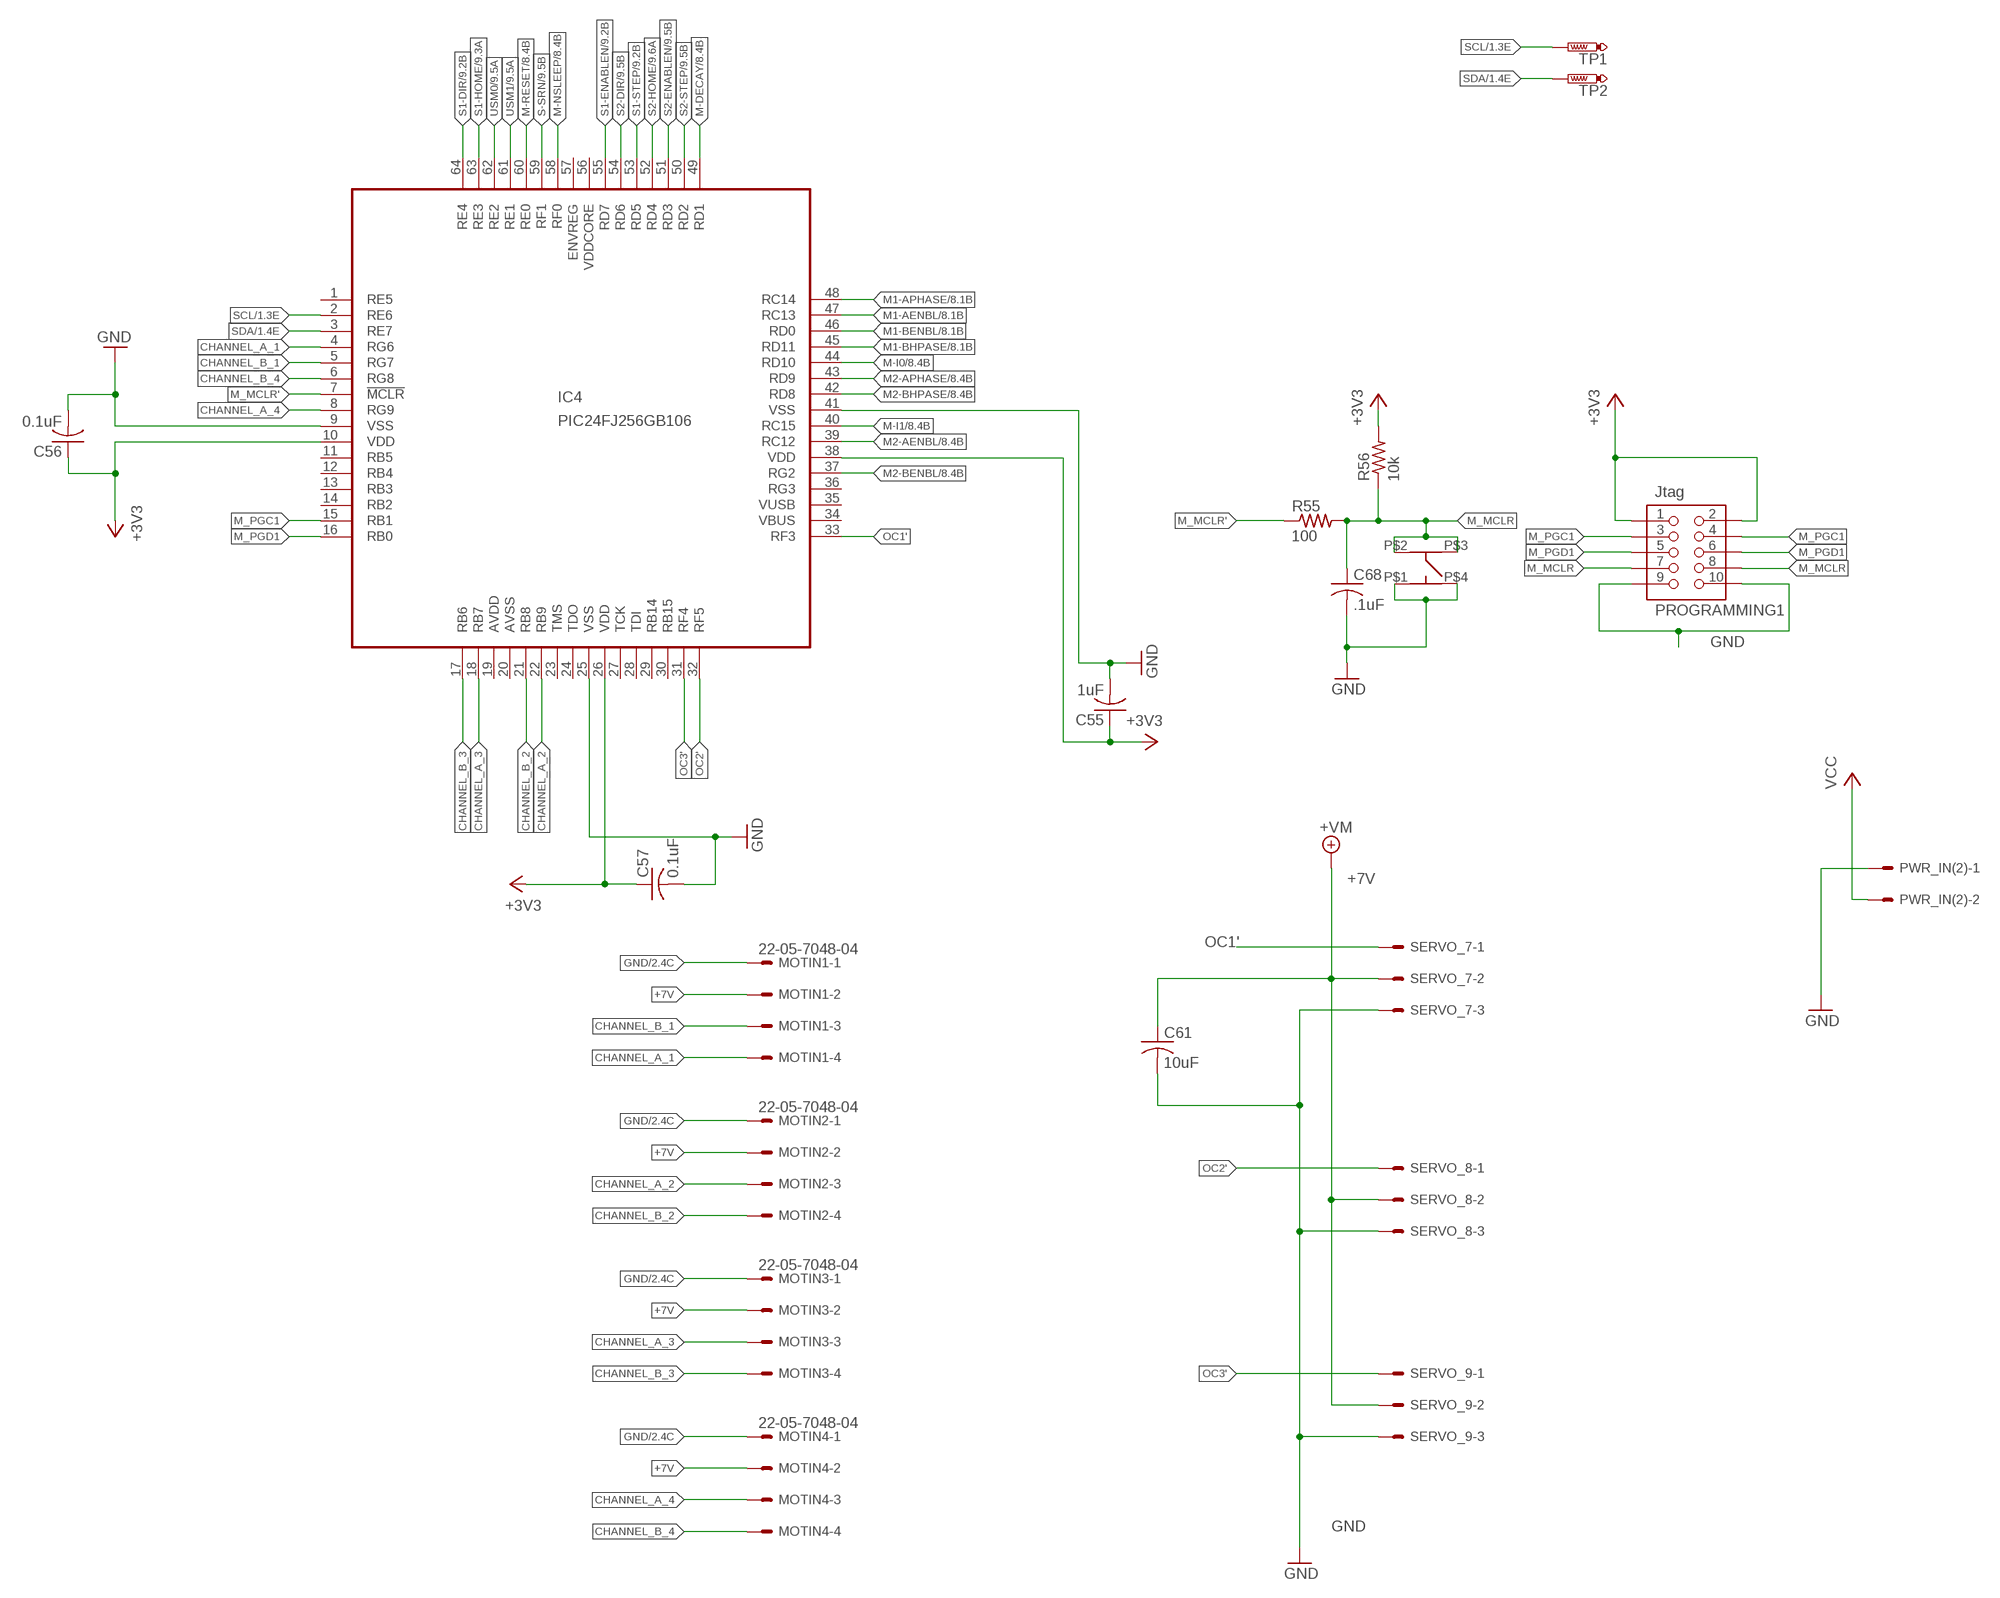
[diagram p10: schematic, sheet 10, part 2 of 2]

### Parts
C55  1uF  C-USC0402  [C0402]
C56  0.1uF  C-USC0402  [C0402]
C57  0.1uF  C-USC0402  [C0402]
C61  10uF  C-USC0805  [C0805]
C68  .1uF  C-USC0402  [C0402]
H2  MOUNT-PAD-ROUND3.0  [3,0-PAD]
H4  MOUNT-PAD-ROUND3.0  [3,0-PAD]
IC4  PIC24FJ256GB106  [TQFP64-10X10]
MOTIN1  22-05-7048-04  [7395-04]
MOTIN2  22-05-7048-04  [7395-04]
MOTIN3  22-05-7048-04  [7395-04]
MOTIN4  22-05-7048-04  [7395-04]
PROGRAMMING1  Jtag  MOTHER-BOARD-REV5_PIN-CONNECTOR74089  [MOTHER-BOARD-REV5_10-PIN-SMD]
PWR_IN(2)  555X-2H  [5569-2]
R55  100  R-US_R0402  [R0402]
R56  10k  R-US_R0402  [R0402]
SERVO_7  22-05-7038-03  [7395-03]
SERVO_8  22-05-7038-03  [7395-03]
SERVO_9  22-05-7038-03  [7395-03]
TP1  PTR1B1,27  [B1,27]
TP2  PTR1B1,27  [B1,27]
U$9  Switch3  MC32882_SW  [MC32882_FINAL]

### Nets
3.3V: C55.1 C56.1 C57.1 IC4.10(VDD) IC4.26(VDD) IC4.38(VDD) PROGRAMMING1.1 PROGRAMMING1.2 R56.2 ; supply symbol labelled +3V3 ; also sheet 1,2,3,9
+7V [VM]: C61.1 H4.B3,0(MOUNT) MOTIN1.2 MOTIN2.2 MOTIN3.2 MOTIN4.2 SERVO_7.2 SERVO_8.2 SERVO_9.2 ; supply symbol labelled +VM ; also sheet 8,9,11
CHANNEL_A_1: IC4.4(RG6) MOTIN1.4
CHANNEL_A_2: IC4.22(RB9) MOTIN2.3
CHANNEL_A_3: IC4.18(RB7) MOTIN3.3
CHANNEL_A_4: IC4.8(RG9) MOTIN4.3
CHANNEL_B_1: IC4.5(RG7) MOTIN1.3
CHANNEL_B_2: IC4.21(RB8) MOTIN2.4
CHANNEL_B_3: IC4.17(RB6) MOTIN3.4
CHANNEL_B_4: IC4.6(RG8) MOTIN4.4
GND: C55.2 C56.2 C57.2 C61.2 C68.2 IC4.9(VSS) IC4.25(VSS) IC4.41(VSS) MOTIN1.1 MOTIN2.1 MOTIN3.1 MOTIN4.1 PROGRAMMING1.9 PROGRAMMING1.10 PWR_IN(2).1 SERVO_7.3 SERVO_8.3 SERVO_9.3 U$9.P$1(P1) U$9.P$4(P4) ; also sheet 1,2,3,4,5,6,7,8,9,11
M1-AENBL: IC4.47(RC13) ; also sheet 8
M1-APHASE: IC4.48(RC14) ; also sheet 8
M1-BENBL: IC4.46(RD0) ; also sheet 8
M1-BHPASE: IC4.45(RD11) ; also sheet 8
M2-AENBL: IC4.39(RC12) ; also sheet 8
M2-APHASE: IC4.43(RD9) ; also sheet 8
M2-BENBL: IC4.37(RG2) ; also sheet 8
M2-BHPASE: IC4.42(RD8) ; also sheet 8
M-DECAY: IC4.49(RD1) ; also sheet 8
M-I0: IC4.44(RD10) ; also sheet 8
M-I1: IC4.40(RC15) ; also sheet 8
M-NSLEEP: IC4.58(RF0) ; also sheet 8,9
M-RESET: IC4.60(RE0) ; also sheet 8,9
M_MCLR: C68.1 PROGRAMMING1.7 PROGRAMMING1.8 R55.2 R56.1 U$9.P$2(P2) U$9.P$3(P3)
M_MCLR': IC4.7(!MCLR) R55.1
M_PGC1: IC4.15(RB1) PROGRAMMING1.3 PROGRAMMING1.4
M_PGD1: IC4.16(RB0) PROGRAMMING1.5 PROGRAMMING1.6
OC1': IC4.33(RF3) SERVO_7.1
OC2': IC4.32(RF5) SERVO_8.1
OC3': IC4.31(RF4) SERVO_9.1
S1-DIR: IC4.64(RE4) ; also sheet 9
S1-ENABLEN: IC4.55(RD7) ; also sheet 9
S1-HOME: IC4.63(RE3) ; also sheet 9
S1-STEP: IC4.53(RD5) ; also sheet 9
S2-DIR: IC4.54(RD6) ; also sheet 9
S2-ENABLEN: IC4.51(RD3) ; also sheet 9
S2-HOME: IC4.52(RD4) ; also sheet 9
S2-STEP: IC4.50(RD2) ; also sheet 9
S-SRN: IC4.59(RF1) ; also sheet 9
SCL: IC4.2(RE6) TP1.TP ; also sheet 1,2
SDA: IC4.3(RE7) TP2.TP ; also sheet 1,2
USM0: IC4.62(RE2) ; also sheet 9
USM1: IC4.61(RE1) ; also sheet 9
VCC: PWR_IN(2).2 ; also sheet 4,5,6,7,11
Unconnected: H2.B3,0(MOUNT) IC4.1(RE5) IC4.11(RB5) IC4.12(RB4) IC4.13(RB3) IC4.14(RB2) IC4.23(TMS) IC4.24(TDO) IC4.27(TCK) IC4.28(TDI) IC4.29(RB14) IC4.30(RB15) IC4.34(VBUS) IC4.35(VUSB) IC4.36(RG3) IC4.57(ENVREG)

## Sheet 11 of 12
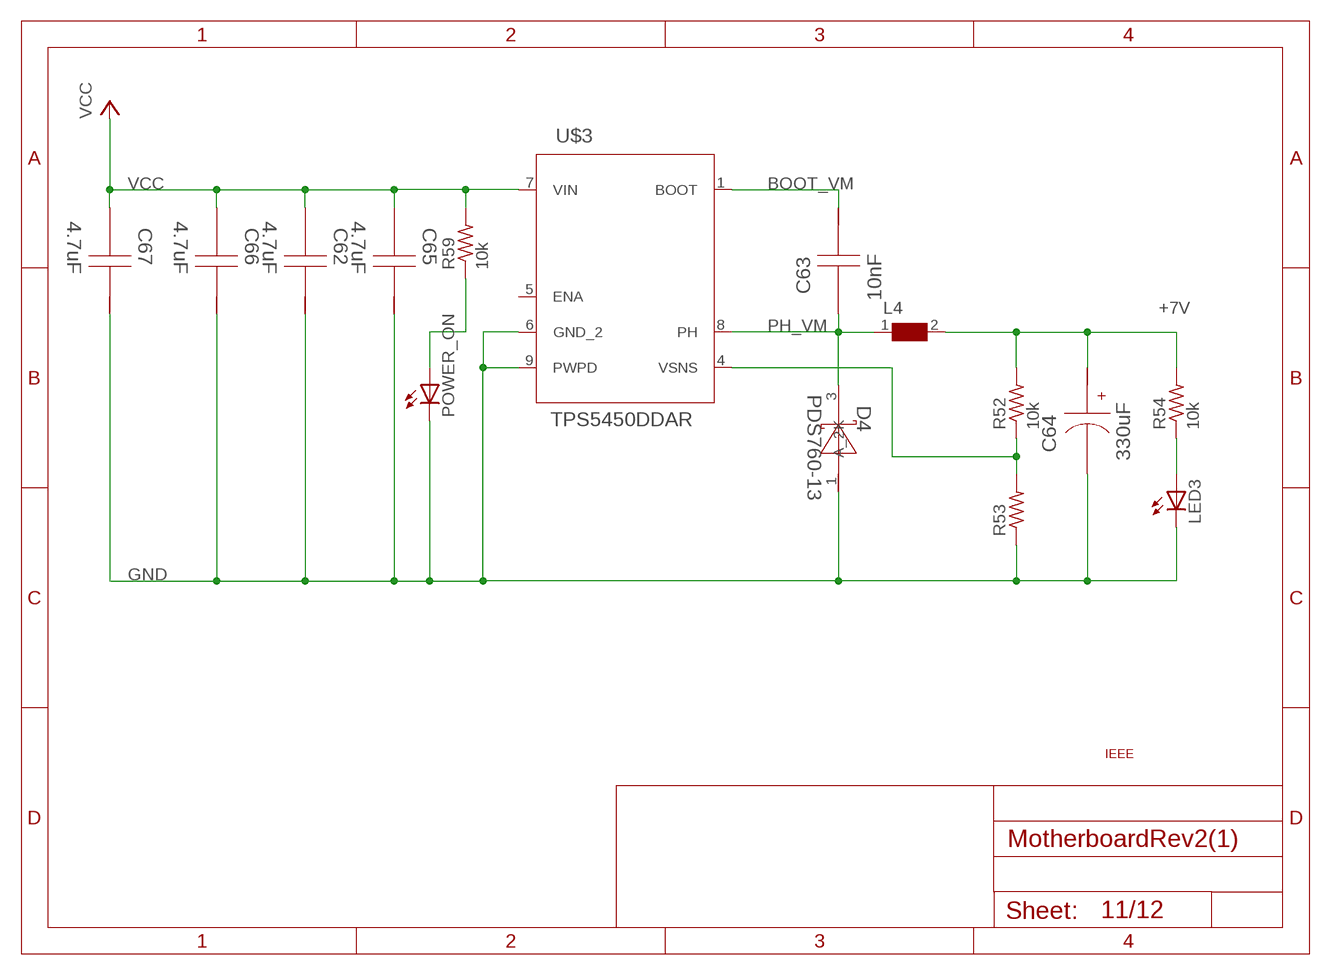
[diagram p11: schematic, sheet 11]

### Parts
C62  4.7uF  GRM31CR71H475KA12L  [1206]
C63  10nF  C0805C103K5RACTU  [0805]
C64  330uF  10SVP330MX  [SM_RADIAL_10AMM]
C65  4.7uF  GRM31CR71H475KA12L  [1206]
C66  4.7uF  GRM31CR71H475KA12L  [1206]
C67  4.7uF  GRM31CR71H475KA12L  [1206]
D4  PDS760-13  [POWERDI5]
L4  WE-HCC-7443331000_1090  [WE-HCC_1090]
LED3  LEDCHIP-LED0603  [CHIP-LED0603]
POWER_ON  LEDCHIP-LED0603  [CHIP-LED0603]
R52  10k  R-US_R0402  [R0402]
R53  R-US_R0402  [R0402]
R54  10k  R-US_R0402  [R0402]
R59  10k  R-US_R0402  [R0402]
U$3  TPS5450DDAR  [R-PDSO-G8]
U$10  LOGO  [LOGO]

### Nets
+7V [VM]: C64.1(+) L4.2 R52.2 R54.2 ; also sheet 8,9,10
BOOT_VM: C63.1 U$3.1(BOOT)
GND: C62.1 C64.2(-) C65.1 C66.1 C67.1 D4.1(A_2) LED3.C POWER_ON.C R53.1 U$3.6(GND_2) U$3.9(PWPD) ; also sheet 1,2,3,4,5,6,7,8,9,10
N$51: LED3.A R54.1
N$52: POWER_ON.A R59.1
PH_VM: C63.2 D4.3(K) L4.1 U$3.8(PH)
VCC: C62.2 C65.2 C66.2 C67.2 R59.2 U$3.7(VIN) ; also sheet 4,5,6,7,10
VSNS_VM: R52.1 R53.2 U$3.4(VSNS)
Unconnected: U$3.5(ENA)

## Sheet 12 of 12

## Power pins joined to a net without a drawn wire
AVDD: IC4.19(AVDD)
AVSS: IC4.20(AVSS)
VDDCORE: IC4.56(VDDCORE)

## Library data of the parts
3.3V 3.3V1 3.3V(2) 3.3V(2)1 5V 5V1 5V(2) 5V(2)1 = Son_of_Dark_Powersch:22-?-02: CONNECTOR wire to board 2.54 mm (.1 inch) pitch header; OC_FARNELL: 9731601; OC_NEWARK: unknown
C1 C2 C6-C8 C10-C13 C16-C22 C25-C28 C30-C37 C39-C57 C61 C68-C70 = rcl:C-US: CAPACITOR, American symbol
C3 C4 C14 C63 = 5v:C0805C103K5RACTU; CAP: 1.0E-8; ESR: 1.739; IRMS: 0.411; MANUFACTURER_NAME: Kemet; MANUFACTURER_PART_NUMBER: C0805C103K5RACTU; VDC: 50.0; VENDOR: Kemet
C5 C9 C15 C64 = 5v:10SVP330MX; CAP: 3.3E-4; DATASHEETURL: http://www.edc.sanyo.com/english/pdf/oscon/E32.pdf; ESR: 0.025; IRMS: 3.7; MANUFACTURER_NAME: Panasonic; MANUFACTURER_PART_NUMBER: 10SVP330MX; VDC: 10.0; VENDOR: Panasonic
C23 C24 C29 C38 = SparkFun-Capacitors:10UF-16V-10%(TANT): CAP-00811 1206/EIA-3216 Tantalum capacitor; PROD_ID: CAP-00811
C58-C60 = rcl:CPOL-US: POLARIZED CAPACITOR, American symbol
C62 C65-C67 = 5v:GRM31CR71H475KA12L; CAP: 4.7E-6; ESR: 0.0; IRMS: 0.0; MANUFACTURER_NAME: MuRata; MANUFACTURER_PART_NUMBER: GRM31CR71H475KA12L; VDC: 50.0; VENDOR: MuRata
D1-D4 = 5v:PDS760-13; DATASHEETURL: www.diodes.com/datasheets/ds30477.pdf; IO: 7.0; MANUFACTURER_NAME: Diodes Inc.; MANUFACTURER_PART_NUMBER: PDS760-13; VENDOR: Diodes Inc.; VFATIO: 0.56; VRRM: 60.0
D5 D7 = SparkFun-LED:LED: LEDs Standard schematic elements and footprints for 5mm, 3mm, 1206, and 0603 sized LEDs. 5mm - Spark Fun Electronics SKU : COM-00529 (and others)
H1-H4 = holes:MOUNT-PAD-ROUND: MOUNTING PAD, round
IC1 IC2 = Motor-Board:DRV8818PWPR: Driver controlador de motor en paquete HTSSOP
IC3 = microchip:PIC18F2*J53: PIC18F47J53 Family High-Performance USB Microcontrollers with nanoWatt XLP Technology Source: Data sheet <http://ww1.microchip.com/downloads/en/DeviceDoc/39964B.pdf>; MPN: PIC18F26J53-I/ML; OC_FARNELL: unknown; OC_NEWARK: 63R7829
IC4 = microchip:PIC24FJ256GB106: PIC24FJ256GB106 edit this description Auto generated by make-symbol-device-package-bsdl.ulp Rev. 25 Source: PIC24FJ256GB106.bsd; MPN: PIC24FJ256GB106-I/PT; OC_FARNELL: 1576868; OC_NEWARK: 54M5129
L1-L4 = WE-HCC:WE-HCC: SMD High Current Cube Inductor WE-HCC - magnetically shieled - current capability up to 27A - excellent saturation characteristics -- filter choke for DC/DC converter -- single and polyphase buck converter -- filter choke for motor electronics; MPN: 7443331000; OC_FARNELL: 1848254; OC_NEWARK: 13T9771; PACKAGE: 1090; SUPPLIER: Wuerth Elektronik
LED1-LED9 POWER_ON = led:LED: LED OSRAM: - CHIPLED LG R971, LG N971, LY N971, LG Q971, LY Q971, LO R971, LY R971 LH N974, LH R974 LS Q976, LO Q976, LY Q976 LO Q996 - Hyper CHIPLED LW Q18S LB Q993, LB Q99A, LB R99A - SideLED LS A670, LO A670, LY A670, LG A670, LP A670 LB A673, LV A673, LT A673, LW A673 LH A674 LY A675 LS A676, LA A676, LO A676, LY A676, LW A676 LS A679, LY A679, LG A679 - Hyper Micro SIDELED® LS Y876, LA Y876, LO Y876, LY Y876 LT Y87S - SmartLED LW L88C, LW L88S LB L89C, LB L89S, LG L890 LS L89K, LO L89K, LY L89K LS L896, LA L896, LO L896, LY L896 - TOPLED LS T670, LO T670, LY T670, LG T670, LP T670 LSG T670, LSP T670, LSY T670, LOP T670, LYG T670 LG T671, LOG T671, LSG T671 LB T673, LV T673, LT T673, LW T673 LH T674 LS T676, LA T676, LO T676, LY T676, LB T676, LH T676, LSB T676, LW T676 LB T67C, LV T67C, LT T67C, LS T67K, LO T67K, LY T67K, LW E67C LS E67B, LA E67B, LO E67B, LY E67B, LB E67C, LV E67C, LT E67C LW T67C LS T679, LY T679, LG T679 LS T770, LO T770, LY T770, LG T770, LP T770 LB T773, LV T773, LT T773, LW T773 LH T774 LS E675, LA E675, LY E675, LS T675 LS T776, LA T776, LO T776, LY T776, LB T776 LHGB T686 LT T68C, LB T68C - Hyper Mini TOPLED® LB M676 - Mini TOPLED Santana® LG M470 LS M47K, LO M47K, LY M47K Source: http://www.osram.convergy.de LUXEON: - LUMILED® LXK2-PW12-R00, LXK2-PW12-S00, LXK2-PW14-U00, LXK2-PW14-V00 LXK2-PM12-R00, LXK2-PM12-S00, LXK2-PM14-U00 LXK2-PE12-Q00, LXK2-PE12-R00, LXK2-PE12-S00, LXK2-PE14-T00, LXK2-PE14-U00 LXK2-PB12-K00, LXK2-PB12-L00, LXK2-PB12-M00, LXK2-PB14-N00, LXK2-PB14-P00, LXK2-PB14-Q00 LXK2-PR12-L00, LXK2-PR12-M00, LXK2-PR14-Q00, LXK2-PR14-R00 LXK2-PD12-Q00, LXK2-PD12-R00, LXK2-PD12-S00 LXK2-PH12-R00, LXK2-PH12-S00 LXK2-PL12-P00, LXK2-PL12-Q00, LXK2-PL12-R00 Source: www.luxeon.com KINGBRIGHT: KA-3528ASYC Source: www.kingbright.com
MOTIN1-MOTIN4 STEP1 STEP2 = Son_of_Dark_Power:22-?-04: CONNECTOR wire to board 2.54 mm (.1 inch) pitch header; OC_FARNELL: unknown; OC_NEWARK: unknown
MOTOR1-MOTOR4 = Son_of_Dark_Power:22-?-02: CONNECTOR wire to board 2.54 mm (.1 inch) pitch header; OC_FARNELL: 9731601; OC_NEWARK: unknown
PROGRAMMING PROGRAMMING1 = Mother-Board-rev5:MOTHER-BOARD-REV5_PIN-CONNECTOR
PWR_IN PWR_IN(2) = Son_of_Dark_Powersch:555X-2: Mini FIT connector 2 way
Q1-Q3 = transistor-small-signal:BSS123: N-CHANNEL MOS FET
R1-R59 = rcl:R-US_: RESISTOR, American symbol
SERVO_1-SERVO_9 = con-molex:22-?-03: CONNECTOR wire to board 2.54 mm (.1 inch) pitch header; OC_FARNELL: unknown; OC_NEWARK: unknown
START_SWITCH = con-lstb:MA03-1: PIN HEADER; OC_FARNELL: unknown; OC_NEWARK: unknown
TP1 TP2 = testpad:PTR1: TEST PIN
U1 U3 = NSC-LMS8117AMP:LMS8117AMP-3.3: Low-Dropout Linear Regulator; MPN: LMS8117AMP-3.3; OC_FARNELL: 1469032; OC_NEWARK: 41K3020; PACKAGE: SOT-223-3; SUPPLIER: National Semiconductor
U2 U4 = Texas Instruments_By_element14_Batch_1:DRV8811PWP: STEPPER MOTOR CONTROLLER IC; MPN: DRV8811PWP; OC_FARNELL: 1754829; OC_NEWARK: 24R9116; PACKAGE: HTSSOP-28; SUPPLIER: Texas Instruments
U$1 = Son_of_Dark_Powersch:BEAGLE_BONE_BLACK_CAPE
U$2-U$4 U$8 = 5v:TPS5450DDAR; DATASHEETURL: http://www.ti.com/product/tps5450; FREQUENCY: 500000.0; IMAX: 5.0; MANUFACTURER_NAME: Texas Instruments; MANUFACTURER_PART_NUMBER: TPS5450DDA; MKTG_PACKAGE: TPS5450; NSID: TPS5450DDAR; PACKAGE: TPS5450; VENDOR: Texas Instruments
U$5-U$7 U$9 U$13 U$14 = Parts4Class:MC32882_SW
U$10 = logo:LOGO

## Net classes
0 default: width 0.203 mm, drill 0.33 mm, clearance 0.254 mm
1 +3v3: width 0.406 mm, drill 0.457 mm, clearance 0.254 mm
2 VM: width 0.508 mm, drill 0.533 mm, clearance 0.254 mm